# Altium project C-F-U-Bridge.PrjPcb
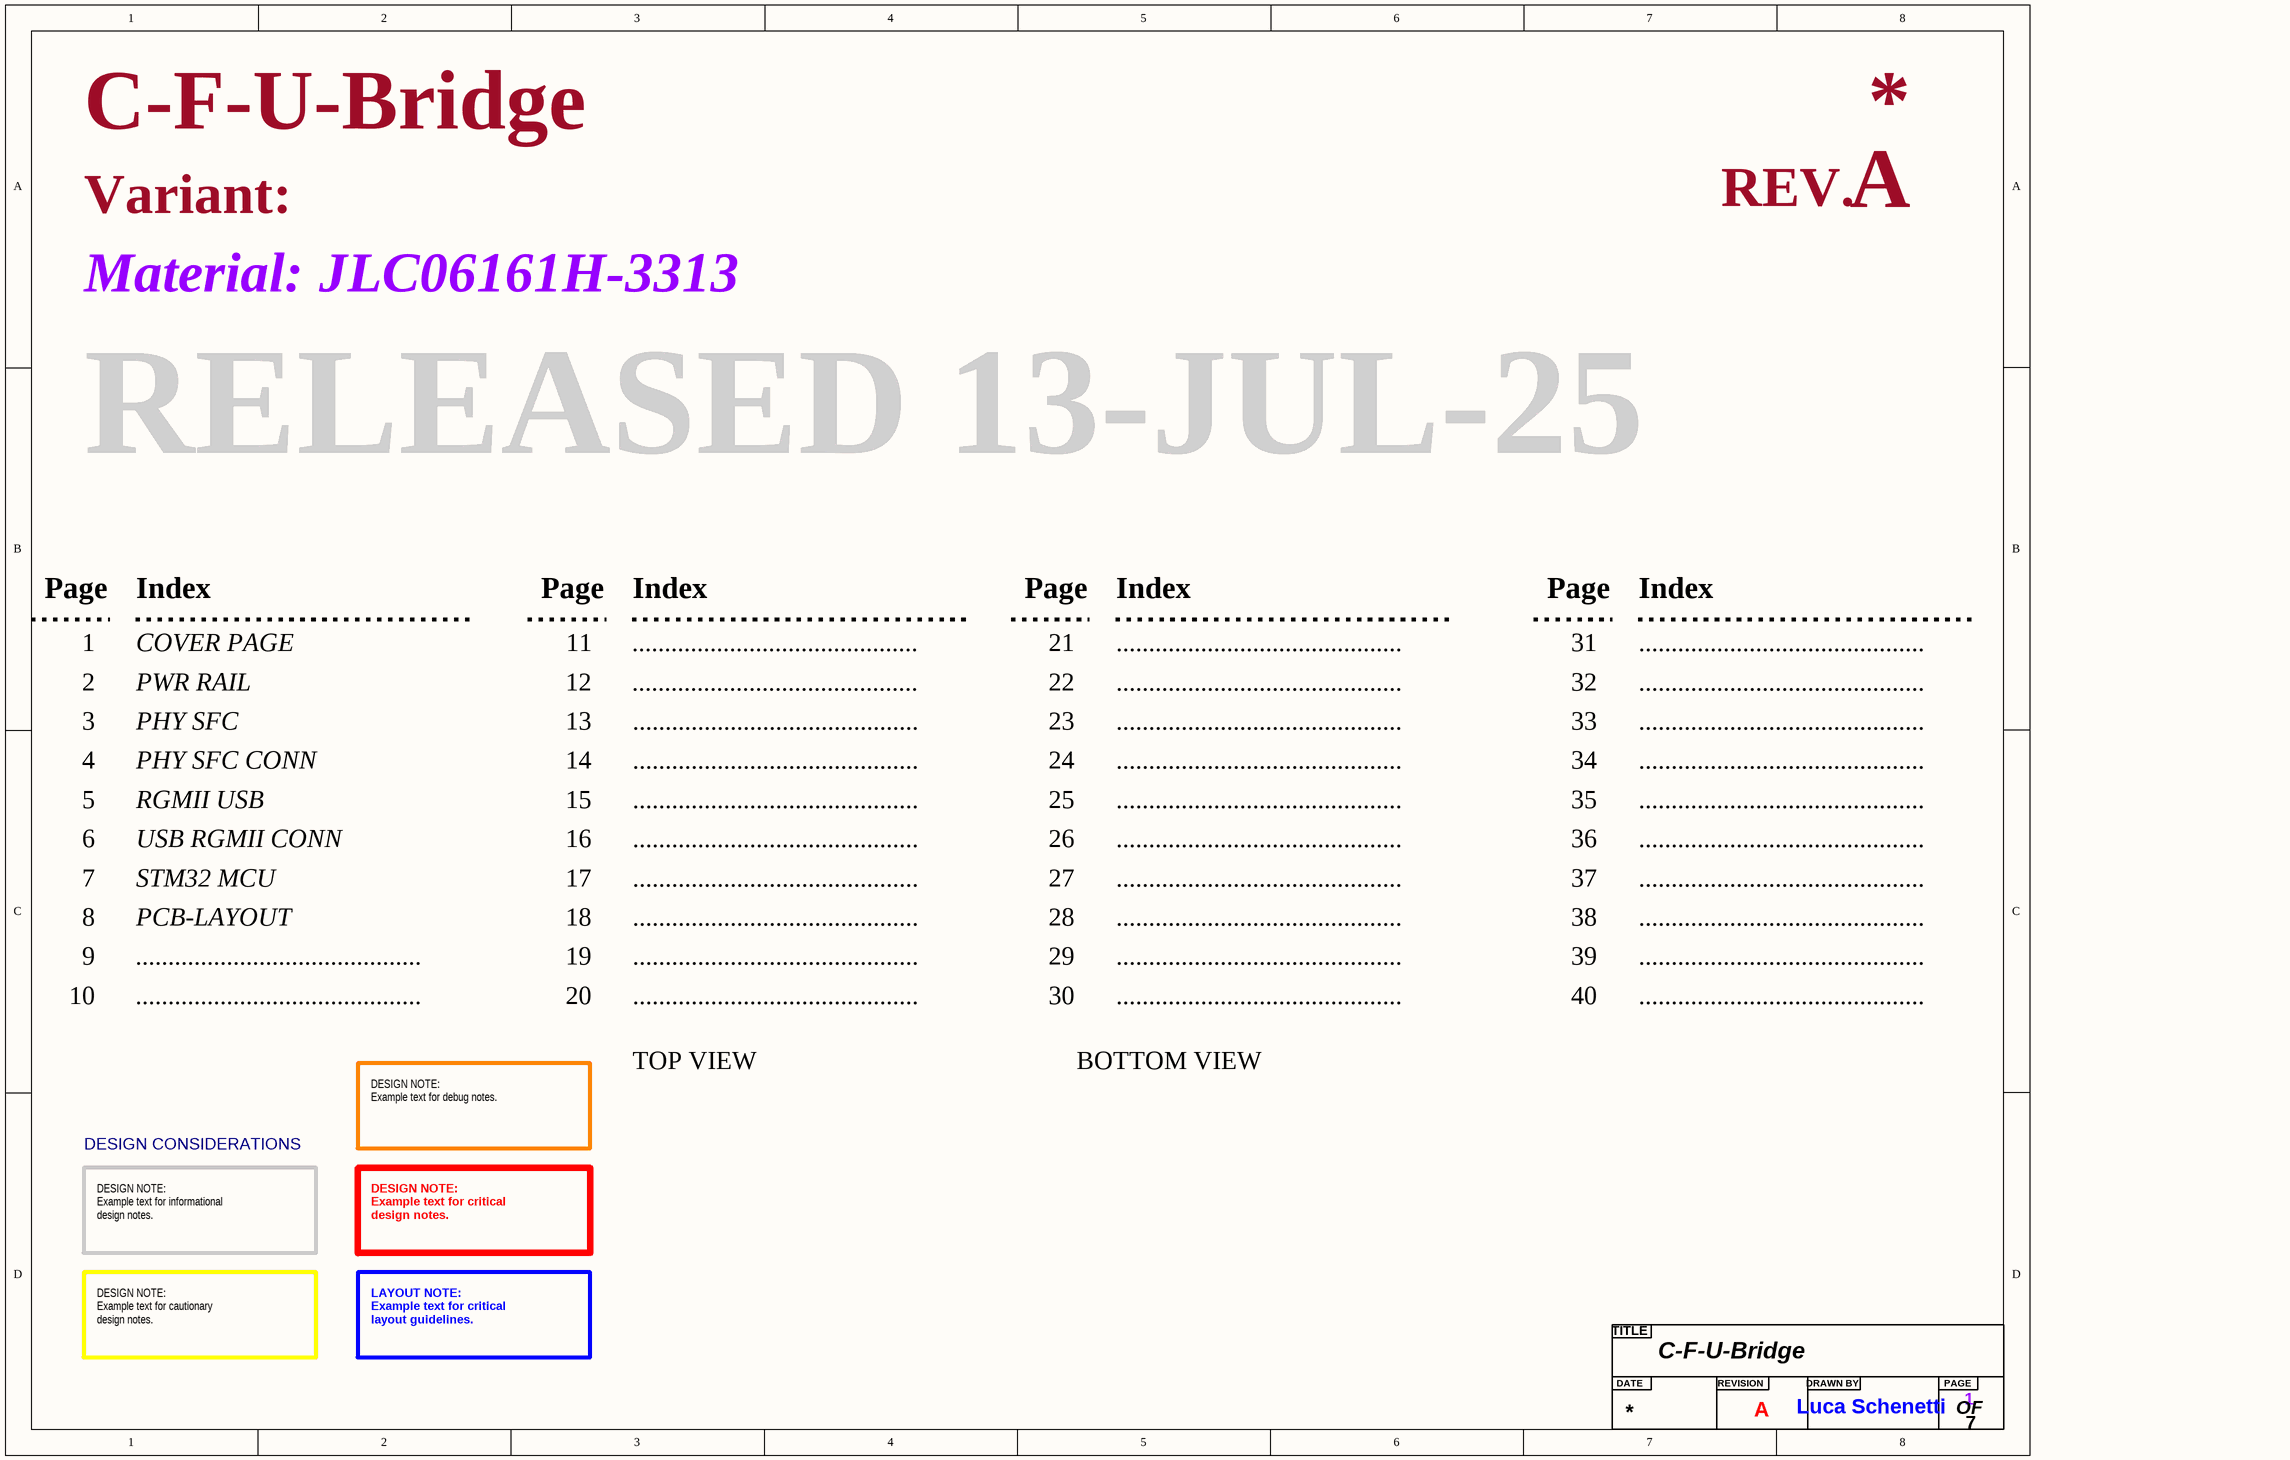
[diagram p0: COVER PAGE.SchDoc]
7 sheets, 212 parts. Net scope: flat (ports and power ports of the same name join across sheets).
Board file: PCB-LAYOUT.PcbDoc
Sheets:
  COVER PAGE.SchDoc
  PWR RAIL.SchDoc
  PHY SFC.SchDoc
  PHY SFC CONN.SchDoc
  RGMII USB.SchDoc
  USB RGMII CONN.SchDoc
  STM32 MCU.SchDoc

## Sheet COVER PAGE.SchDoc: C-F-U-Bridge
size A3; DrawnBy: Luca Schenetti; Engineer: Luca Schenetti; Revision: A; SheetNumber: 1; SheetTotal: 7; Material: JLC06161H-3313

### Parts
(Parts that share a designator on the sheet are numbered #1, #2 ... from top to bottom, then left to right.)
?#1  Title  (value not drawn)  (graphical)

### Notes on the sheet
- Variant:
- REV.
- Material:
- RELEASED 13-JUL-25
- Page
- Index
- 1
- 2
- COVER PAGE
- PWR RAIL
- 11
- 12
- ............................................
- 21
- 22
- 31
- 32
- 3
- PHY SFC
- 13
- 23
- 33
- 4
- 5
- PHY SFC CONN
- RGMII USB
- 14
- 15
- 24
- 25
- 34
- 35
- 6
- 7
- STM32 MCU
- USB RGMII CONN
- 16
- 17
- 26
- 27
- 36
- 37
- 8
- PCB-LAYOUT
- 18
- 28
- 38
- 9
- 10
- 19
- 20
- 29
- 30
- 39
- 40
- TOP VIEW
- BOTTOM VIEW
- DESIGN CONSIDERATIONS
- DESIGN NOTE:
  Example text for debug notes.
- DESIGN NOTE:
  Example text for informational
  design notes.
- DESIGN NOTE:
  Example text for critical
  design notes.
- DESIGN NOTE:
  Example text for cautionary
  design notes.
- LAYOUT NOTE:
  Example text for critical
  layout guidelines.
- (in symbol Title) TITLE; DATE; REVISION; DRAWN BY; PAGE; OF

## Sheet PWR RAIL.SchDoc: C-F-U-Bridge
size A3; ApprovedBy: Luca Schenetti; CheckedBy: Luca Schenetti; Author: Luca Schenetti; DrawnBy: Luca Schenetti; Engineer: Luca Schenetti; Revision: A; SheetNumber: 2; SheetTotal: 7
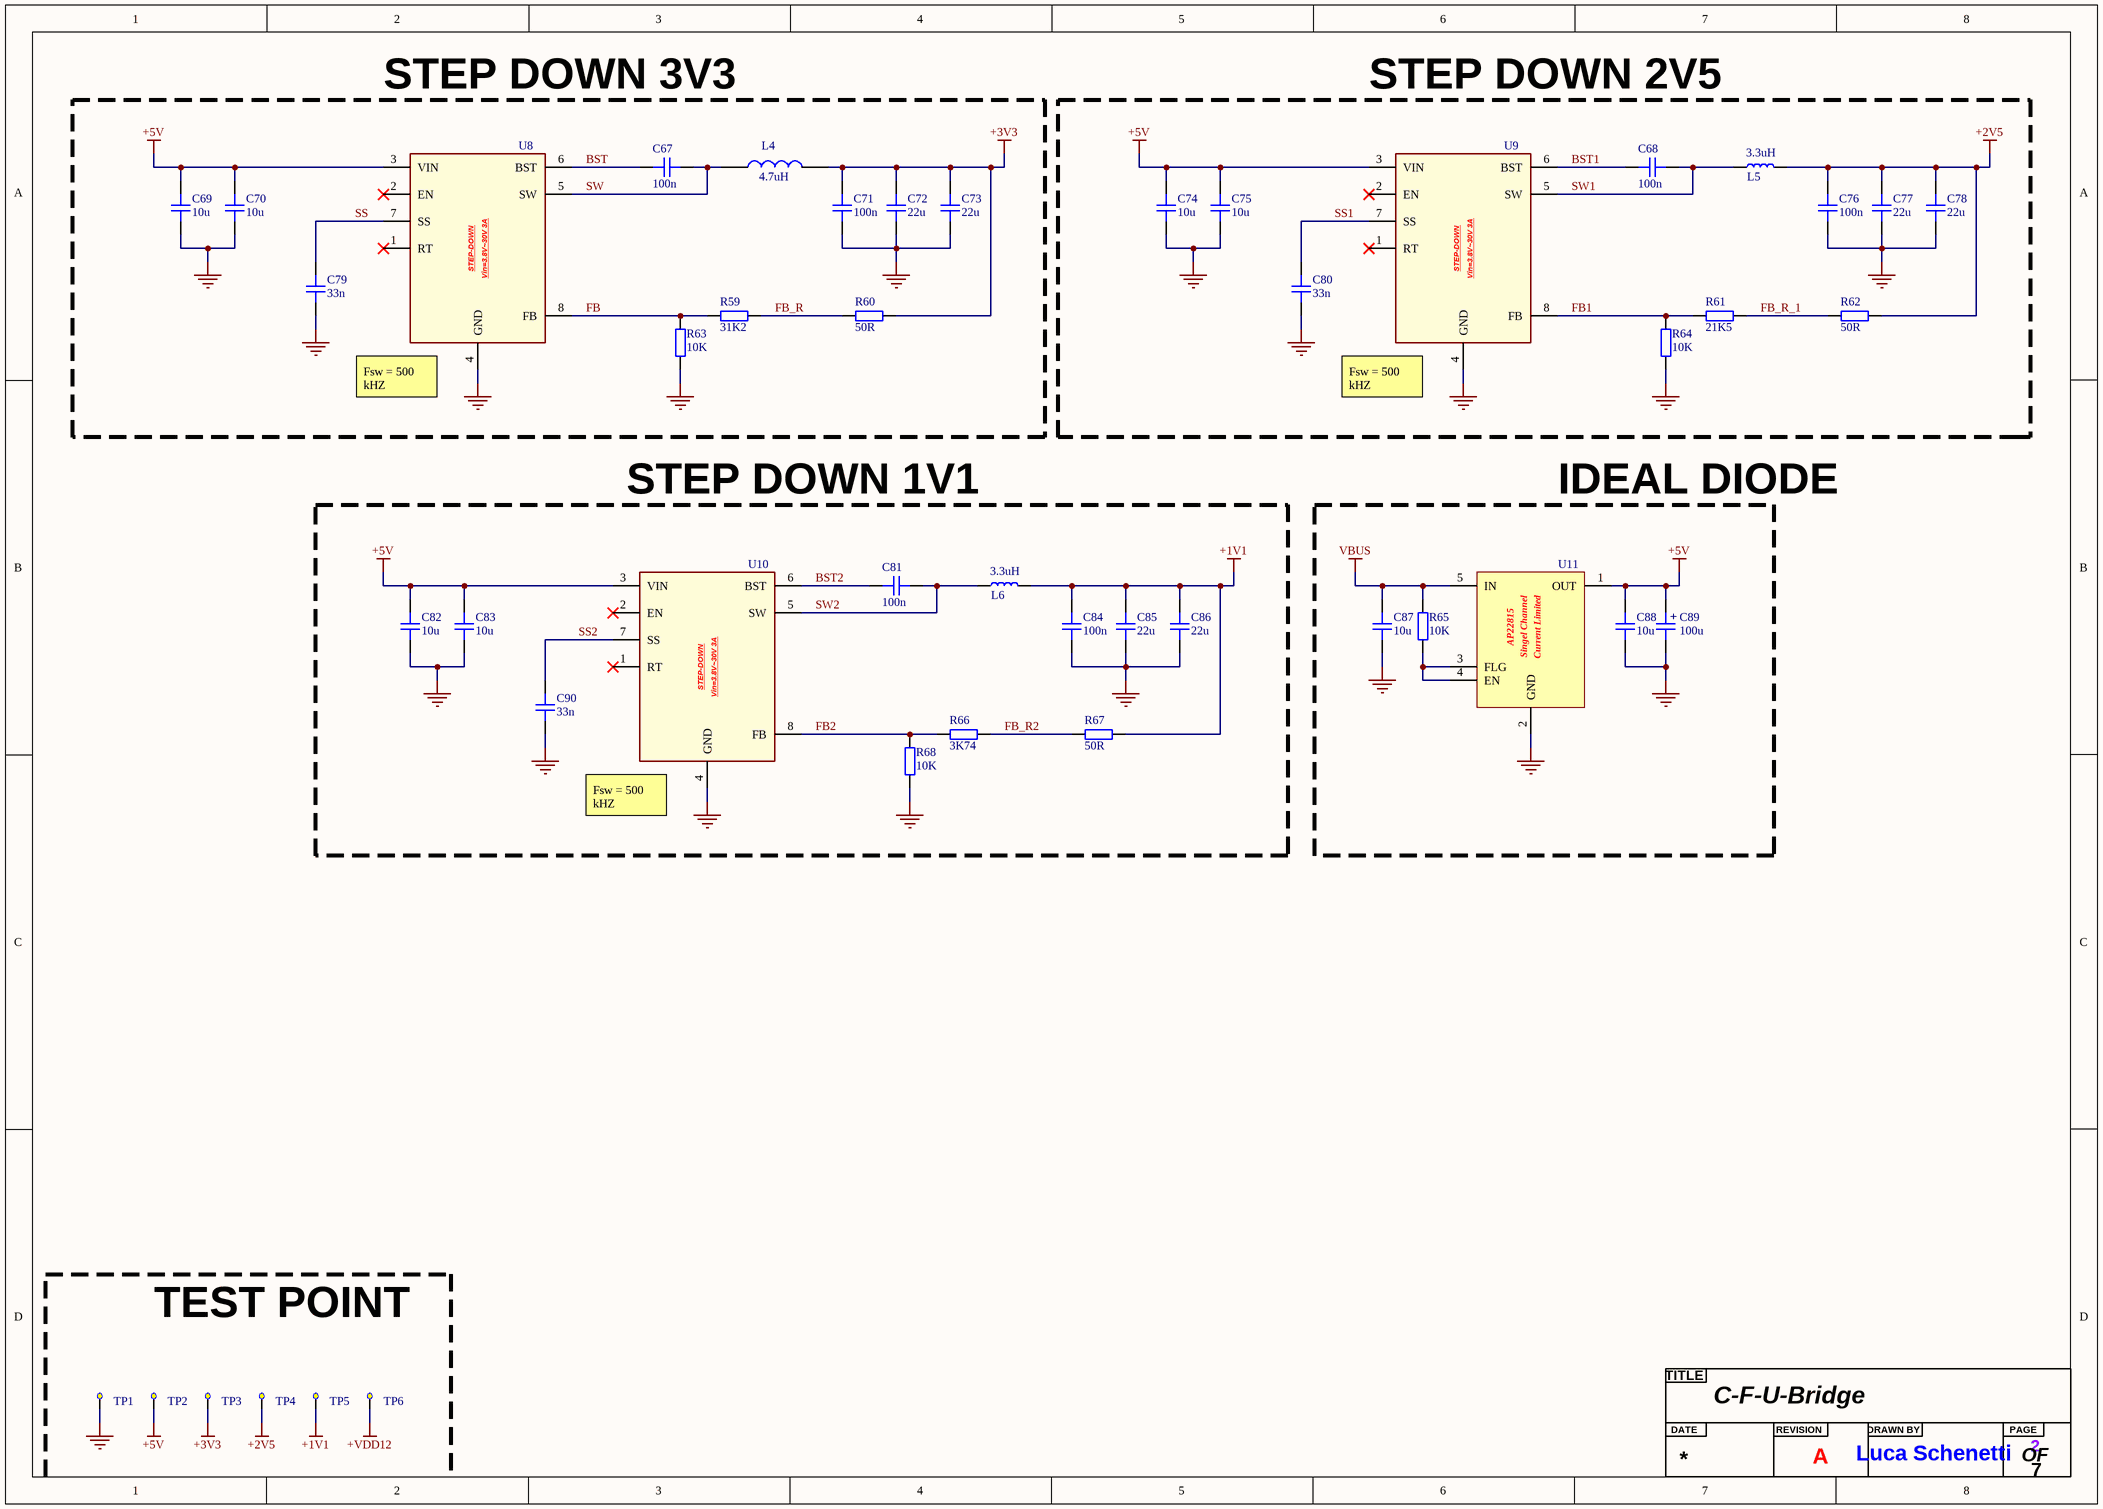
[diagram p1: PWR RAIL.SchDoc]

### Parts
(Parts that share a designator on the sheet are numbered #1, #2 ... from top to bottom, then left to right.)
?#2  Title  (value not drawn)  (graphical)
C67  100n  [CAP_0603]
C68  100n  [CAP_0603]
C69  10u  [CAP_0805]
C70  10u  [CAP_0805]
C71  100n  [CAP_0603]
C72  22u  [CAP_0603]
C73  22u  [CAP_0603]
C74  10u  [CAP_0805]
C75  10u  [CAP_0805]
C76  100n  [CAP_0603]
C77  22u  [CAP_0603]
C78  22u  [CAP_0603]
C79  33n  [CAP_0603]
C80  33n  [CAP_0603]
C81  100n  [CAP_0603]
C82  10u  [CAP_0805]
C83  10u  [CAP_0805]
C84  100n  [CAP_0603]
C85  22u  [CAP_0603]
C86  22u  [CAP_0603]
C87  10u  [CAP_0603]
C88  10u  [CAP_0603]
C89  100u  [CAP_AE_SMD_D6MM3_H5M55]
C90  33n  [CAP_0603]
L4  4.7uH  [FXL0530-4R7-M]
L5  3.3uH  [FXL0420-3R3-M]
L6  3.3uH  [FXL0420-3R3-M]
R59  31K2  [RES_0603]
R60  50R  [RES_0603]
R61  21K5  [RES_0603]
R62  50R  [RES_0603]
R63  10K  [RES_0603]
R64  10K  [RES_0603]
R65  10K  [RES_0603]
R66  3K74  [RES_0603]
R67  50R  [RES_0603]
R68  10K  [RES_0603]
TP1  Test Point  [Test Point]  (value not drawn)  (no BOM)
TP2  Test Point  [Test Point]  (value not drawn)  (no BOM)
TP3  Test Point  [Test Point]  (value not drawn)  (no BOM)
TP4  Test Point  [Test Point]  (value not drawn)  (no BOM)
TP5  Test Point  [Test Point]  (value not drawn)  (no BOM)
TP6  Test Point  [Test Point]  (value not drawn)  (no BOM)
U8  Step Down Converter 3A 3.8V~30V  [TPS62933DRLR]  (value not drawn)
U9  Step Down Converter 3A 3.8V~30V  [TPS62933DRLR]  (value not drawn)
U10  Step Down Converter 3A 3.8V~30V  [TPS62933DRLR]  (value not drawn)
U11  Single-Channel, Current-Limited  [AP22815]  (value not drawn)

### Blocks framed on the sheet
STEP DOWN 3V3: C67 C69-C73 C79 L4 R59 R60 R63 U8
STEP DOWN 2V5: C68 C74-C78 C80 L5 R61 R62 R64 U9
IDEAL DIODE: C87-C89 R65 U11

### Nets
+1V1: C84.1 C85.2 C86.2 L6.2 R67.1 TP5.1(Test_Point)
+2V5: C76.1 C77.2 C78.2 L5.2 R62.1 TP4.1(Test_Point)
+3V3: C71.1 C72.2 C73.2 L4.2 R60.1 TP3.1(Test_Point)
+5V: C69.2 C70.2 C74.2 C75.2 C82.2 C83.2 C88.2 C89.1 TP2.1(Test_Point) U8.3(VIN) U9.3(VIN) U10.3(VIN) U11.1(OUT)
+VDD12: TP6.1(Test_Point)
GND: C69.1 C70.1 C71.2 C72.1 C73.1 C74.1 C75.1 C76.2 C77.1 C78.1 C79.2 C80.2 C82.1 C83.1 C84.2 C85.1 C86.1 C87.1 C88.1 C89.2 C90.2 R63.1 R64.1 R68.1 TP1.1(Test_Point) U8.4(GND) U9.4(GND) U10.4(GND) U11.2(GND)
VBUS: C87.2 R65.2 U11.5(IN)
BST: C67.2 U8.6(BST)
BST1: C68.2 U9.6(BST)
BST2: C81.2 U10.6(BST)
FB: R59.2 R63.2 U8.8(FB)
FB1: R61.2 R64.2 U9.8(FB)
FB2: R66.2 R68.2 U10.8(FB)
FB_R: R59.1 R60.2
FB_R2: R66.1 R67.2
FB_R_1: R61.1 R62.2
SS: C79.1 U8.7(SS)
SS1: C80.1 U9.7(SS)
SS2: C90.1 U10.7(SS)
SW: C67.1 L4.1 U8.5(SW)
SW1: C68.1 L5.1 U9.5(SW)
SW2: C81.1 L6.1 U10.5(SW)
NetR65_1: R65.1 U11.3(FLG) U11.4(EN)

Not connected (* = marked no-connect by the designer): U8 1(RT)* 2(EN)*; U9 1(RT)* 2(EN)*; U10 1(RT)* 2(EN)*

### Notes on the sheet
- (near U8) Fsw = 500 kHZ
- (near U9) Fsw = 500 kHZ
- STEP DOWN 1V1
- (near U10) Fsw = 500 kHZ
- TEST POINT
- (in symbol AP22815AWT-7) AP22815; Singel Channel; Current Limited
- (in symbol CAP_ALEL_6.3x5.5) +
- (in symbol Title) TITLE; DATE; REVISION; DRAWN BY; PAGE; OF
- (in symbol TPS62933DRLR) STEP-DOWN; Vin=3.8V~30V 3A

### Library data of the parts
C67 C68 C71 C76 C81 C84 = CAP_0603: Capacitor SMD 0603 [C14663]; Manufacturer: *; Manufacturer Part Number: *; Distributor Link: *; LCSC: *; Rating: *; Dielectric: *
C69 C70 C74 C75 C82 C83 = CAP_0805: Capacitor SMD 0805[C440198]; Manufacturer: *; Manufacturer Part Number: *; Distributor Link: *; LCSC: *; Rating: *; Dielectric: *
C72 C73 C77 C78 C85 C86 = CAP_0603: Capacitor SMD 0603 [C59461]; Manufacturer: *; Manufacturer Part Number: *; Distributor Link: *; LCSC: *; Rating: *; Dielectric: *
C79 C80 C90 = CAP_0603: [C21117]; Manufacturer: *; Manufacturer Part Number: *; Distributor Link: *; LCSC: *; Rating: *; Dielectric: *
C87 C88 = CAP_0603: [C96446]; Manufacturer: *; Manufacturer Part Number: *; Distributor Link: *; LCSC: *; Rating: *; Dielectric: *
C89 = CAP_ALEL_6.3x5.5: [C59936]; Manufacturer: *; Manufacturer Part Number: *; Distributor Link: *; LCSC: *
L4 = FXL0530-4R7-M: [C177246]
L5 L6 = FXL0420-3R3-M: [C167207]
R59 = RES_0603: [C863036]; Manufacturer: *; Manufacturer Part Number: *; Distributor Link: *; LCSC: *
R60 R62 R67 = RES_0603: [C849792]; Manufacturer: *; Manufacturer Part Number: *; Distributor Link: *; LCSC: *
R61 = RES_0603: [C22911]; Manufacturer: *; Manufacturer Part Number: *; Distributor Link: *; LCSC: *
R63-R65 R68 = RES_0603: [C25804]; Manufacturer: *; Manufacturer Part Number: *; Distributor Link: *; LCSC: *
R66 = RES_0603: [C23016]; Manufacturer: *; Manufacturer Part Number: *; Distributor Link: *; LCSC: *
U8-U10 = TPS62933DRLR: [C3200405]
U11 = AP22815AWT-7: [C2150007]
TP1-TP6 = Test Point: Value: Test Point

## Sheet PHY SFC.SchDoc: C-F-U-Bridge
size A3; ApprovedBy: Luca Schenetti; CheckedBy: Luca Schenetti; Author: Luca Schenetti; Engineer: Luca Schenetti; Revision: A; SheetNumber: 3; SheetTotal: 7
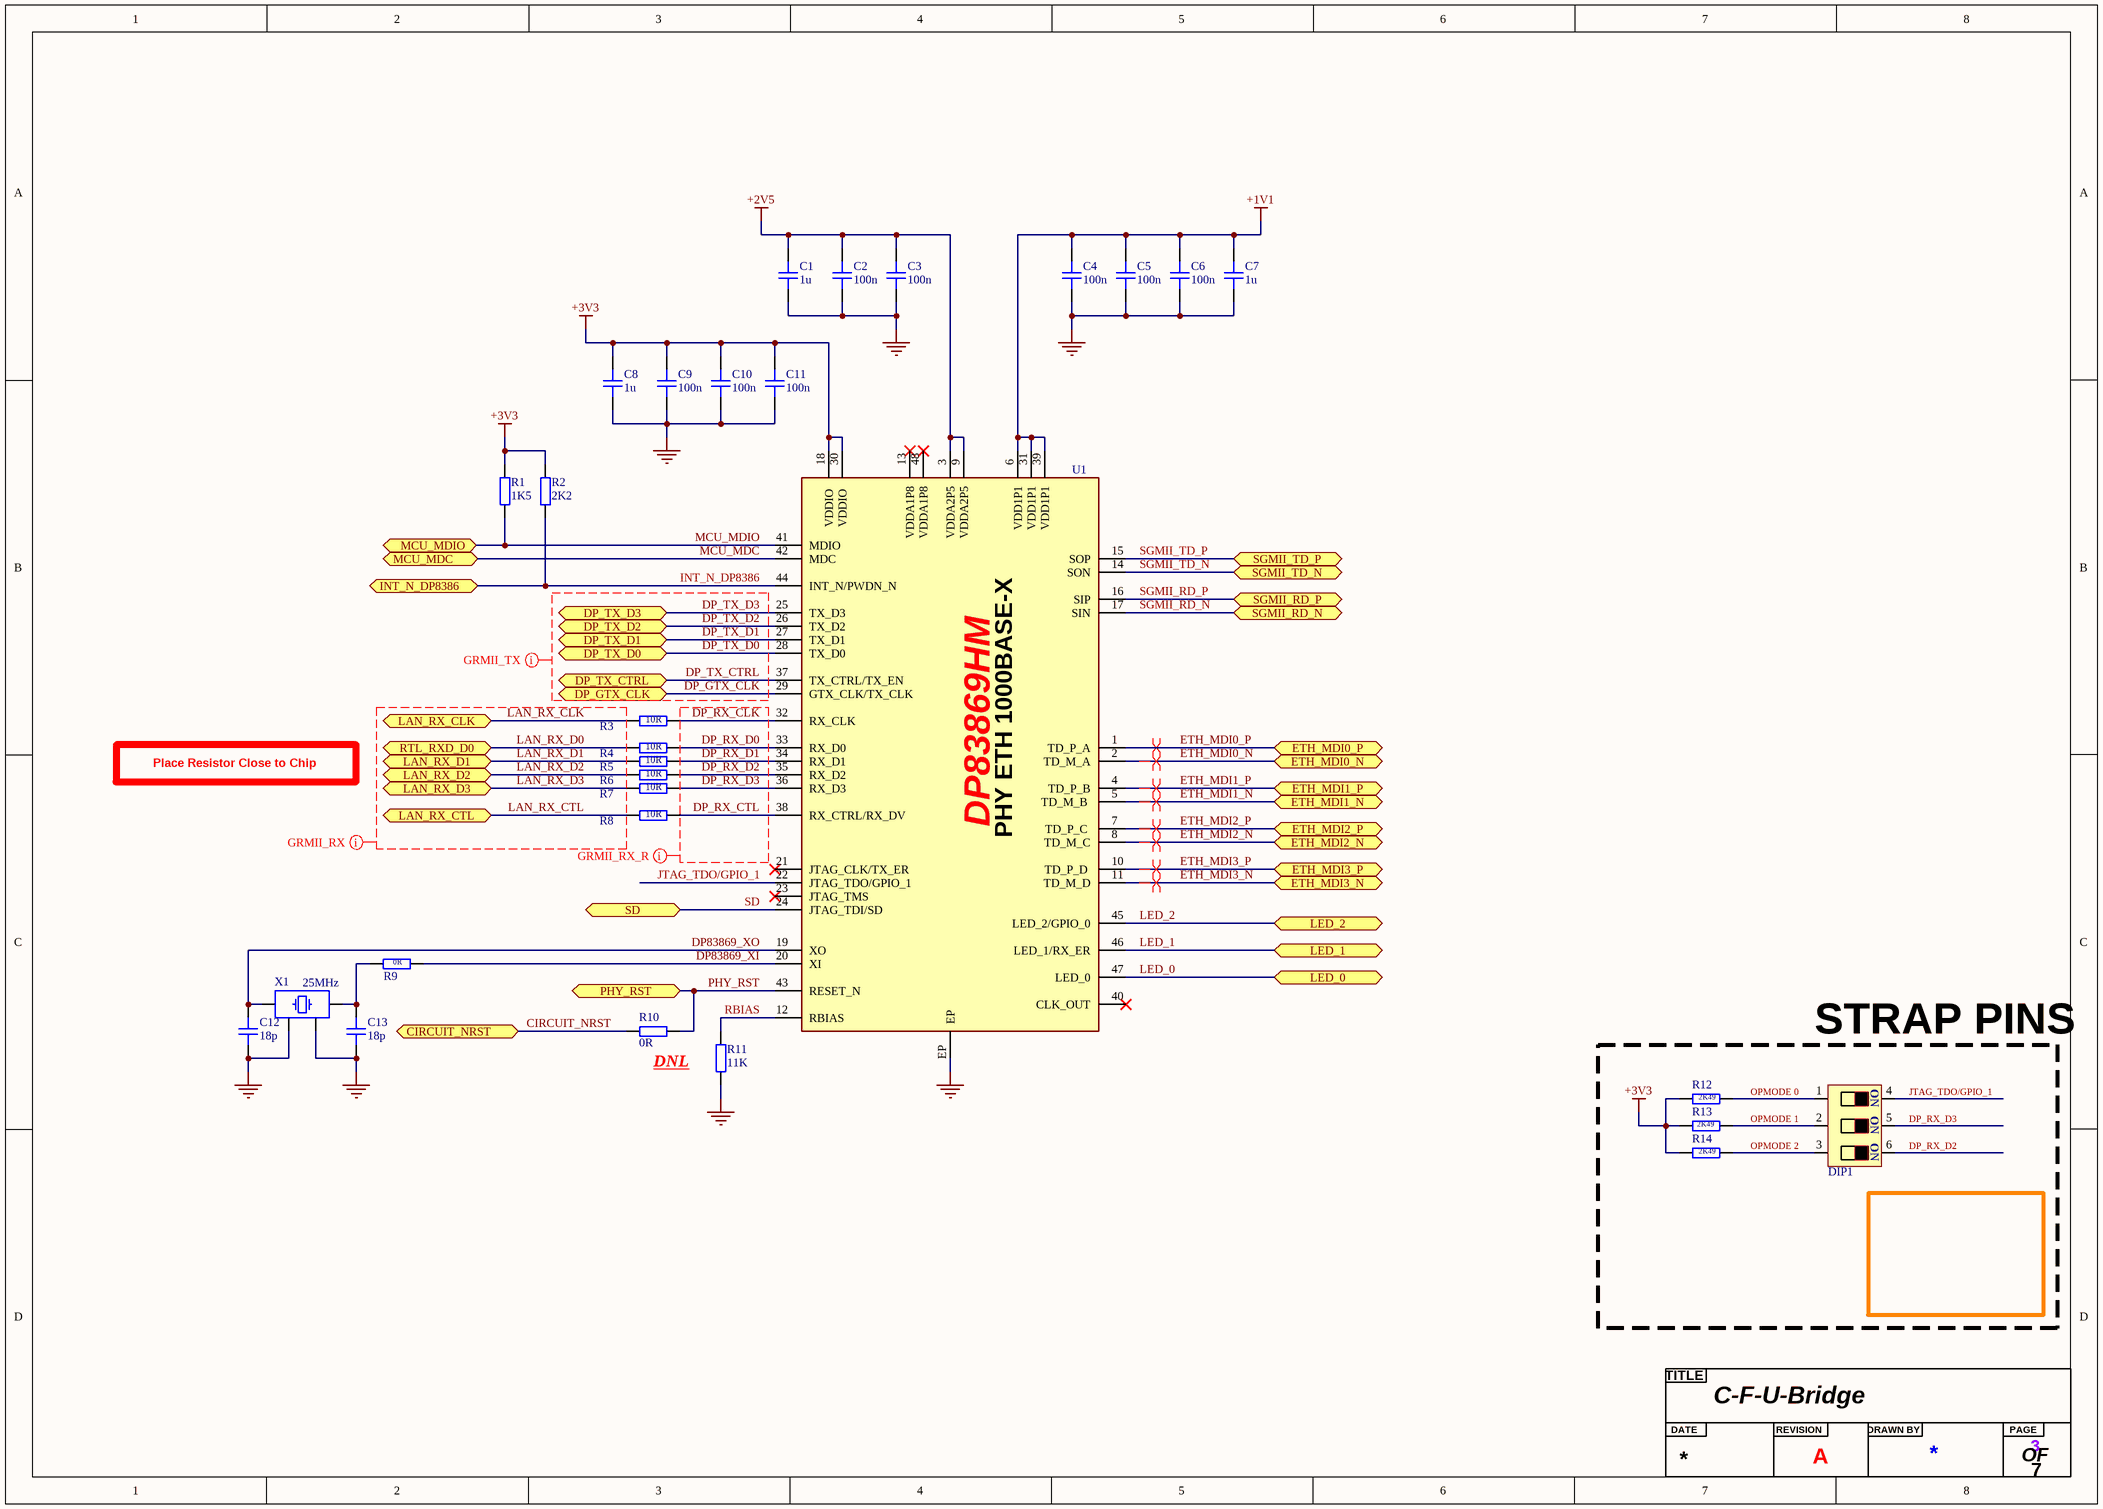
[diagram p2: PHY SFC.SchDoc]

### Parts
(Parts that share a designator on the sheet are numbered #1, #2 ... from top to bottom, then left to right.)
?#3  Title  (value not drawn)  (graphical)
C1  1u  [CAP_0603]
C2  100n  [CAP_0603]
C3  100n  [CAP_0603]
C4  100n  [CAP_0603]
C5  100n  [CAP_0603]
C6  100n  [CAP_0603]
C7  1u  [CAP_0603]
C8  1u  [CAP_0603]
C9  100n  [CAP_0603]
C10  100n  [CAP_0603]
C11  100n  [CAP_0603]
C12  18p  [CAP_0402]
C13  18p  [CAP_0402]
DIP1  3 POS DIP SWITCH  [DSWB03LHGET]  (value not drawn)
R1  1K5  [RES_0603]
R2  2K2  [RES_0603]
R3  10R  [RES_0402]
R4  10R  [RES_0402]
R5  10R  [RES_0402]
R6  10R  [RES_0402]
R7  10R  [RES_0402]
R8  10R  [RES_0402]
R9  0R  [RES_0402]
R10  0R  [RES_0603]  (no BOM)
R11  11K  [RES_0603]
R12  2K49  [RES_0603]
R13  2K49  [RES_0603]
R14  2K49  [RES_0603]
U1  PHY ETH 1000BASE-X/1000BASE-T  [DP83869HMRGZT]  (value not drawn)
X1  25MHz  [XTAL_3225]

### Blocks framed on the sheet
STRAP PINS: DIP1 R12-R14

### Ports
CIRCUIT_NRST (bidir, see RGMII USB[3D], STM32 MCU[7A]), DP_GTX_CLK (bidir, see RGMII USB[2C]), DP_TX_CTRL (bidir, see RGMII USB[2C]), DP_TX_D0 (bidir, see RGMII USB[2C]), DP_TX_D1 (bidir, see RGMII USB[2C]), DP_TX_D2 (bidir, see RGMII USB[2C]), DP_TX_D3 (bidir, see RGMII USB[2C]), ETH_MDI0_N (bidir, see PHY SFC CONN[1C]), ETH_MDI0_P (bidir, see PHY SFC CONN[1C]), ETH_MDI1_N (bidir, see PHY SFC CONN[1C]), ETH_MDI1_P (bidir, see PHY SFC CONN[1C]), ETH_MDI2_N (bidir, see PHY SFC CONN[1C]), ETH_MDI2_P (bidir, see PHY SFC CONN[1C]), ETH_MDI3_N (bidir, see PHY SFC CONN[1C]), ETH_MDI3_P (bidir, see PHY SFC CONN[1C]), INT_N_DP8386 (bidir, see STM32 MCU[2C]), LAN_RX_CLK (bidir, see RGMII USB[3C]), LAN_RX_CTL (bidir, see RGMII USB[3C]), LAN_RX_D1 (bidir, see RGMII USB[3C]), LAN_RX_D2 (bidir, see RGMII USB[3C]), LAN_RX_D3 (bidir, see RGMII USB[3C]), LED_0 (bidir, see PHY SFC CONN[5A]), LED_1 (bidir, see PHY SFC CONN[6B]), LED_2 (bidir, see PHY SFC CONN[5A]), MCU_MDC (bidir, see STM32 MCU[4C]), MCU_MDIO (bidir, see STM32 MCU[4C]), PHY_RST (bidir, see RGMII USB[3D]), RTL_RXD_D0 (bidir, see RGMII USB[3C]), SD (bidir, see PHY SFC CONN[4B]), SGMII_RD_N (bidir, see PHY SFC CONN[1B]), SGMII_RD_P (bidir, see PHY SFC CONN[1B]), SGMII_TD_N (bidir, see PHY SFC CONN[1B]), SGMII_TD_P (bidir, see PHY SFC CONN[1B])

### Nets
+1V1: C4.2 C5.2 C6.2 C7.2 U1.6(VDD1P1) U1.31(VDD1P1) U1.39(VDD1P1)
+2V5: C1.2 C2.2 C3.2 U1.3(VDDA2P5) U1.9(VDDA2P5)
+3V3: C8.2 C9.2 C10.2 C11.2 R1.2 R2.2 R12.2 R13.2 R14.2 U1.18(VDDIO) U1.30(VDDIO)
GND: C1.1 C2.1 C3.1 C4.1 C5.1 C6.1 C7.1 C8.1 C9.1 C10.1 C11.1 C12.1 C13.1 R11.1 U1.EP X1.2 X1.4
CIRCUIT_NRST: R10.1 ; port CIRCUIT_NRST
DP83869_XI: R9.2 U1.20(XI)
DP83869_XO: C12.2 U1.19(XO) X1.3
DP_GTX_CLK: U1.29(GTX_CLK/TX_CLK) ; port DP_GTX_CLK
DP_RX_CLK: R3.2 U1.32(RX_CLK)
DP_RX_CTL: R8.2 U1.38(RX_CTRL/RX_DV)
DP_RX_D0: R4.2 U1.33(RX_D0)
DP_RX_D1: R5.2 U1.34(RX_D1)
DP_RX_D2: DIP1.6 R6.2 U1.35(RX_D2)
DP_RX_D3: DIP1.5 R7.2 U1.36(RX_D3)
DP_TX_CTRL: U1.37(TX_CTRL/TX_EN) ; port DP_TX_CTRL
DP_TX_D0: U1.28(TX_D0) ; port DP_TX_D0
DP_TX_D1: U1.27(TX_D1) ; port DP_TX_D1
DP_TX_D2: U1.26(TX_D2) ; port DP_TX_D2
DP_TX_D3: U1.25(TX_D3) ; port DP_TX_D3
ETH_MDI0_N: U1.2(TD_M_A) ; port ETH_MDI0_N
ETH_MDI0_P: U1.1(TD_P_A) ; port ETH_MDI0_P
ETH_MDI1_N: U1.5(TD_M_B) ; port ETH_MDI1_N
ETH_MDI1_P: U1.4(TD_P_B) ; port ETH_MDI1_P
ETH_MDI2_N: U1.8(TD_M_C) ; port ETH_MDI2_N
ETH_MDI2_P: U1.7(TD_P_C) ; port ETH_MDI2_P
ETH_MDI3_N: U1.11(TD_M_D) ; port ETH_MDI3_N
ETH_MDI3_P: U1.10(TD_P_D) ; port ETH_MDI3_P
INT_N_DP8386: R2.1 U1.44(INT_N/PWDN_N) ; port INT_N_DP8386
JTAG_TDO/GPIO_1: DIP1.4 U1.22(JTAG_TDO/GPIO_1)
LAN_RX_CLK: R3.1 ; port LAN_RX_CLK
LAN_RX_CTL: R8.1 ; port LAN_RX_CTL
LAN_RX_D0: R4.1 ; port RTL_RXD_D0
LAN_RX_D1: R5.1 ; port LAN_RX_D1
LAN_RX_D2: R6.1 ; port LAN_RX_D2
LAN_RX_D3: R7.1 ; port LAN_RX_D3
LED_0: U1.47(LED_0) ; port LED_0
LED_1: U1.46(LED_1/RX_ER) ; port LED_1
LED_2: U1.45(LED_2/GPIO_0) ; port LED_2
MCU_MDC: U1.42(MDC) ; port MCU_MDC
MCU_MDIO: R1.1 U1.41(MDIO) ; port MCU_MDIO
OPMODE 0: DIP1.1 R12.1
OPMODE 1: DIP1.2 R13.1
OPMODE 2: DIP1.3 R14.1
PHY_RST: R10.2 U1.43(RESET_N) ; port PHY_RST
RBIAS: R11.2 U1.12(RBIAS)
SD: U1.24(JTAG_TDI/SD) ; port SD
SGMII_RD_N: U1.17(SIN) ; port SGMII_RD_N
SGMII_RD_P: U1.16(SIP) ; port SGMII_RD_P
SGMII_TD_N: U1.14(SON) ; port SGMII_TD_N
SGMII_TD_P: U1.15(SOP) ; port SGMII_TD_P
NetC13_2: C13.2 R9.1 X1.1

Not connected (* = marked no-connect by the designer): U1 13(VDDA1P8)* 21(JTAG_CLK/TX_ER)* 23(JTAG_TMS)* 40(CLK_OUT)* 48(VDDA1P8)*

### Layout directives
differential pair; differential pair class DIFF_MDI_100Ω; rule Matched Net Lengths [Delay Tolerance = 50ps]: ETH_MDI0_N, ETH_MDI0_P, ETH_MDI1_N, ETH_MDI1_P, ETH_MDI2_N, ETH_MDI2_P, ETH_MDI3_N, ETH_MDI3_P
net class GRMII_RX_R; rule Matched Net Lengths [Delay Tolerance = 20ps]: DP_RX_CLK, DP_RX_CTL, DP_RX_D0, DP_RX_D1, DP_RX_D2, DP_RX_D3
net class GRMII_TX; rule Matched Net Lengths [Delay Tolerance = 20ps]: DP_GTX_CLK, DP_TX_CTRL, DP_TX_D0, DP_TX_D1, DP_TX_D2, DP_TX_D3
net class GRMII_RX; rule Matched Net Lengths [Delay Tolerance = 20ps]: LAN_RX_CLK, LAN_RX_CTL, LAN_RX_D0, LAN_RX_D1, LAN_RX_D2, LAN_RX_D3

### Notes on the sheet
- Place Resistor Close to Chip
- (near R10) DNL
- (in symbol DP83869HMRGZT) PHY ETH 1000BASE-X; DP83869HM
- (in symbol DSWB03LHGET) ON
- (in symbol Title) TITLE; DATE; REVISION; DRAWN BY; PAGE; OF

### Library data of the parts
C1 C7 C8 = CAP_0603: [C15849]; Manufacturer: *; Manufacturer Part Number: *; Distributor Link: *; LCSC: *; Rating: *; Dielectric: *
C2-C6 C9-C11 = CAP_0603: [C14663]; Manufacturer: *; Manufacturer Part Number: *; Distributor Link: *; LCSC: *; Rating: *; Dielectric: *
C12 C13 = CAP_0402: Capacitor SMD 0402 [C1549]; Manufacturer: *; Manufacturer Part Number: *; Distributor Link: *; LCSC: *; Rating: *; Dielectric: *
DIP1 = DSWB03LHGET: [C99420]
R1 = RES_0603: [C22843]; Manufacturer: *; Manufacturer Part Number: *; Distributor Link: *; LCSC: *
R2 = RES_0603: [C4190]; Manufacturer: *; Manufacturer Part Number: *; Distributor Link: *; LCSC: *
R3-R8 = RES_0402: [C25077]; Manufacturer: *; Manufacturer Part Number: *; Distributor Link: *; LCSC: *
R9 = RES_0402: Resistor SMD 0402 [C17168]; Manufacturer: *; Manufacturer Part Number: *; Distributor Link: *; LCSC: *
R10 = RES_0603: Manufacturer: *; Manufacturer Part Number: *; Distributor Link: *; LCSC: *
R11 = RES_0603: [C25950]; Manufacturer: *; Manufacturer Part Number: *; Distributor Link: *; LCSC: *
R12-R14 = RES_0603: [C22908]; Manufacturer: *; Manufacturer Part Number: *; Distributor Link: *; LCSC: *
U1 = DP83869HMRGZT: [C2671580]
X1 = TSX-3225_24.0000MF15X-AC: Crystal SMD 24MHz 10PPM 7pF 3225 [C9006]; Manufacturer: Epson; Manufacturer Part Number: TSX-3225 24.0000MF15X-AC

## Sheet PHY SFC CONN.SchDoc: C-F-U-Bridge
size A3; ApprovedBy: Luca Schenetti; CheckedBy: Luca Schenetti; Author: Luca Schenetti; DrawnBy: Luca Schenetti; Revision: A; SheetNumber: 4; SheetTotal: 7
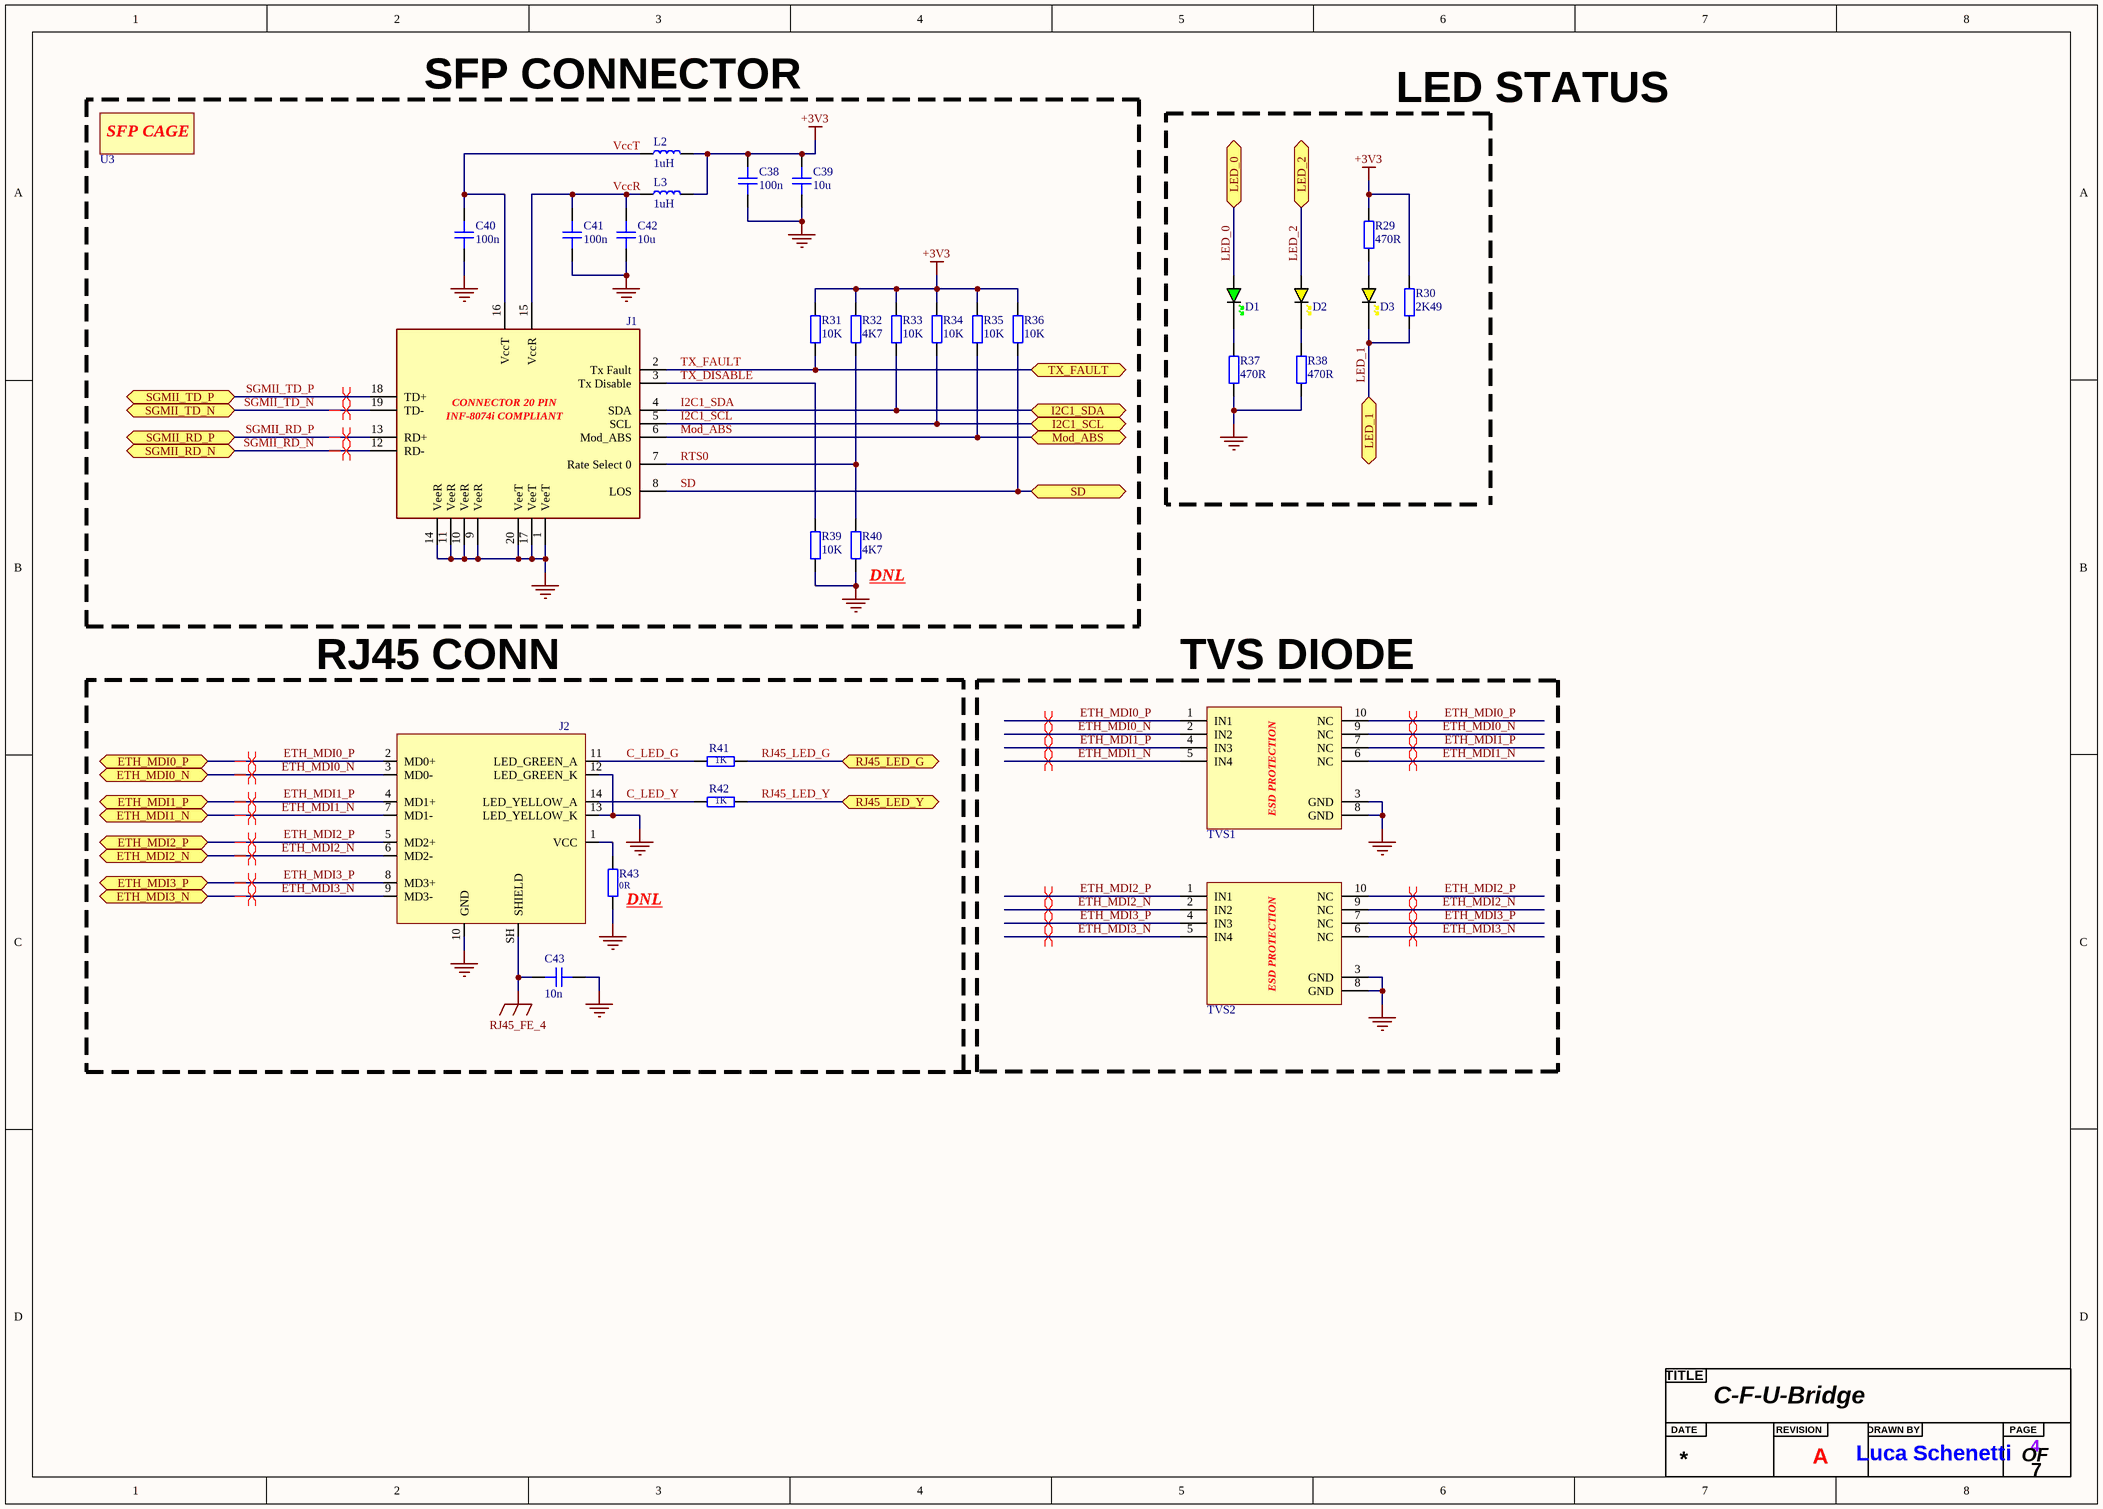
[diagram p3: PHY SFC CONN.SchDoc]

### Parts
(Parts that share a designator on the sheet are numbered #1, #2 ... from top to bottom, then left to right.)
?#4  Title  (value not drawn)  (graphical)
C38  100n  [CAP_0603]
C39  10u  [CAP_0603]
C40  100n  [CAP_0603]
C41  100n  [CAP_0603]
C42  10u  [CAP_0603]
C43  10n  [CAP_1206]
D1  GREEN  [LED_0603_GREEN]  (value not drawn)
D2  YELLOW  [LED_0603_YELLOW]  (value not drawn)
D3  YELLOW  [LED_0603_YELLOW]  (value not drawn)
J1  SHELL 20 PIN FOR SFP CAGE  [1367073-1]  (value not drawn)
J2  100/1000Base-T RJ45 MAGJACK  [HR911130A]  (value not drawn)
L2  1uH  [IND_0603]
L3  1uH  [IND_0603]
R29  470R  [RES_0603]
R30  2K49  [RES_0603]
R31  10K  [RES_0402]
R32  4K7  [RES_0402]
R33  10K  [RES_0402]
R34  10K  [RES_0402]
R35  10K  [RES_0402]
R36  10K  [RES_0402]
R37  470R  [RES_0603]
R38  470R  [RES_0603]
R39  10K  [RES_0402]
R40  4K7  [RES_0402]  (no BOM)
R41  1K  [RES_0603]
R42  1K  [RES_0603]
R43  0R  [RES_0402]  (no BOM)
TVS1  TVS ARRAY  [RClamp0524PATCT]  (value not drawn)
TVS2  TVS ARRAY  [RClamp0524PATCT]  (value not drawn)
U3  SFP-CAGE  [2227023-1]  (value not drawn)

### Blocks framed on the sheet
SFP CONNECTOR: C38-C42 J1 L2 L3 R31-R36 R39 R40 U3

### Ports
ETH_MDI0_N (bidir, see PHY SFC[5C]), ETH_MDI0_P (bidir, see PHY SFC[5B]), ETH_MDI1_N (bidir, see PHY SFC[5C]), ETH_MDI1_P (bidir, see PHY SFC[5C]), ETH_MDI2_N (bidir, see PHY SFC[5C]), ETH_MDI2_P (bidir, see PHY SFC[5C]), ETH_MDI3_N (bidir, see PHY SFC[5C]), ETH_MDI3_P (bidir, see PHY SFC[5C]), I2C1_SCL (bidir, see STM32 MCU[4C]), I2C1_SDA (bidir, see STM32 MCU[4C]), LED_0 (bidir, see PHY SFC[5C]), LED_1 (bidir, see PHY SFC[5C]), LED_2 (bidir, see PHY SFC[5C]), Mod_ABS (bidir, see STM32 MCU[2D]), RJ45_LED_G (bidir, see STM32 MCU[2C]), RJ45_LED_Y (bidir, see STM32 MCU[2C]), SD (bidir, see PHY SFC[3C]), SGMII_RD_N (bidir, see PHY SFC[5B]), SGMII_RD_P (bidir, see PHY SFC[5B]), SGMII_TD_N (bidir, see PHY SFC[5B]), SGMII_TD_P (bidir, see PHY SFC[5B]), TX_FAULT (bidir, see STM32 MCU[4C])

### Nets
+3V3: C38.2 C39.2 L2.1 L3.1 R29.2 R30.2 R31.2 R32.2 R33.2 R34.2 R35.2 R36.2
GND: C38.1 C39.1 C40.1 C41.1 C42.1 C43.2 J1.1(VeeT) J1.9(VeeR) J1.10(VeeR) J1.11(VeeR) J1.14(VeeR) J1.17(VeeT) J1.20(VeeT) J2.10(GND) J2.12(LED_GREEN_K) J2.13(LED_YELLOW_K) R37.1 R38.1 R39.1 R40.1 R43.1 TVS1.3(GND) TVS1.8(GND) TVS2.3(GND) TVS2.8(GND)
RJ45_FE_4: C43.1 J2.SH(SHIELD)
C_LED_G: J2.11(LED_GREEN_A) R41.2
C_LED_Y: J2.14(LED_YELLOW_A) R42.2
ETH_MDI0_N: J2.3(MD0-) TVS1.2(IN2) TVS1.9(NC) ; port ETH_MDI0_N
ETH_MDI0_P: J2.2(MD0+) TVS1.1(IN1) TVS1.10(NC) ; port ETH_MDI0_P
ETH_MDI1_N: J2.7(MD1-) TVS1.5(IN4) TVS1.6(NC) ; port ETH_MDI1_N
ETH_MDI1_P: J2.4(MD1+) TVS1.4(IN3) TVS1.7(NC) ; port ETH_MDI1_P
ETH_MDI2_N: J2.6(MD2-) TVS2.2(IN2) TVS2.9(NC) ; port ETH_MDI2_N
ETH_MDI2_P: J2.5(MD2+) TVS2.1(IN1) TVS2.10(NC) ; port ETH_MDI2_P
ETH_MDI3_N: J2.9(MD3-) TVS2.5(IN4) TVS2.6(NC) ; port ETH_MDI3_N
ETH_MDI3_P: J2.8(MD3+) TVS2.4(IN3) TVS2.7(NC) ; port ETH_MDI3_P
I2C1_SCL: J1.5(SCL) R34.1 ; port I2C1_SCL
I2C1_SDA: J1.4(SDA) R33.1 ; port I2C1_SDA
LED_0: D1.A ; port LED_0
LED_1: D3.K R30.1 ; port LED_1
LED_2: D2.A ; port LED_2
Mod_ABS: J1.6(Mod_ABS) R35.1 ; port Mod_ABS
RJ45_LED_G: R41.1 ; port RJ45_LED_G
RJ45_LED_Y: R42.1 ; port RJ45_LED_Y
RTS0: J1.7(Rate_Select_0) R32.1 R40.2
SD: J1.8(LOS) R36.1 ; port SD
SGMII_RD_N: J1.12(RD-) ; port SGMII_RD_N
SGMII_RD_P: J1.13(RD+) ; port SGMII_RD_P
SGMII_TD_N: J1.19(TD-) ; port SGMII_TD_N
SGMII_TD_P: J1.18(TD+) ; port SGMII_TD_P
TX_DISABLE: J1.3(Tx_Disable) R39.2
TX_FAULT: J1.2(Tx_Fault) R31.1 ; port TX_FAULT
VccR: C41.2 C42.2 J1.15(VccR) L3.2
VccT: C40.2 J1.16(VccT) L2.2
NetD1_K: D1.K R37.2
NetD2_K: D2.K R38.2
NetD3_A: D3.A R29.1
NetJ2_1: J2.1(VCC) R43.2

### Layout directives
differential pair; differential pair class DIFF_SGMII_100Ω; rule Matched Net Lengths [Delay Tolerance = 15ps]: SGMII_RD_N, SGMII_RD_P, SGMII_TD_N, SGMII_TD_P
differential pair; differential pair class DIFF_MDI_100Ω: ETH_MDI0_N, ETH_MDI0_P, ETH_MDI1_N, ETH_MDI1_P, ETH_MDI2_N, ETH_MDI2_P, ETH_MDI3_N, ETH_MDI3_P
differential pair; differential pair class DIFF_MDI_100Ω; rule Matched Net Lengths [Delay Tolerance = 50ps]: ETH_MDI0_N, ETH_MDI0_P, ETH_MDI1_N, ETH_MDI1_P, ETH_MDI2_N, ETH_MDI2_P, ETH_MDI3_N, ETH_MDI3_P

### Notes on the sheet
- LED STATUS
- (near R40) DNL
- RJ45 CONN
- (near TVS1) TVS DIODE
- (near R43) DNL
- (in symbol 1367073-1) CONNECTOR 20 PIN; INF‑8074i COMPLIANT
- (in symbol 2227023-1) SFP CAGE
- (in symbol RClamp0524PATCT) ESD PROTECTION
- (in symbol Title) TITLE; DATE; REVISION; DRAWN BY; PAGE; OF

### Library data of the parts
C38 C40 C41 = CAP_0603: [C14663]; Manufacturer: *; Manufacturer Part Number: *; Distributor Link: *; LCSC: *; Rating: *; Dielectric: *
C39 C42 = CAP_0603: [C19702]; Manufacturer: *; Manufacturer Part Number: *; Distributor Link: *; LCSC: *; Rating: *; Dielectric: *
C43 = CAP_1206: [C1846]; Manufacturer: *; Manufacturer Part Number: *; Distributor Link: *; LCSC: *; Rating: *; Dielectric: *
D1 = LED_0603_GREEN: [C2986059]
D2 D3 = LED_0603_YELLOW: [C84269]
J1 = 1367073-1: [C210158]
J2 = HR911130A: [C54408]; Manufacturer: Hanrun; Manufacturer Part Number: HR911130A
L2 L3 = IND_0603: [C383366]
R29 R37 R38 = RES_0603: [C23179]; Manufacturer: *; Manufacturer Part Number: *; Distributor Link: *; LCSC: *
R30 = RES_0603: [C22908]; Manufacturer: *; Manufacturer Part Number: *; Distributor Link: *; LCSC: *
R31 R33-R36 R39 = RES_0402: [C25744]; Manufacturer: *; Manufacturer Part Number: *; Distributor Link: *; LCSC: *
R32 = RES_0402: [C23162]; Manufacturer: *; Manufacturer Part Number: *; Distributor Link: *; LCSC: *
R40 = RES_0402: Manufacturer: *; Manufacturer Part Number: *; Distributor Link: *; LCSC: *
R41 R42 = RES_0603: [C21190]; Manufacturer: *; Manufacturer Part Number: *; Distributor Link: *; LCSC: *
R43 = RES_0402: Resistor SMD 0402; Manufacturer: *; Manufacturer Part Number: *; Distributor Link: *; LCSC: *
TVS1 TVS2 = RClamp0524PATCT: [C40960]
U3 = 2227023-1: [C589693]

## Sheet RGMII USB.SchDoc: C-F-U-Bridge
size A3; ApprovedBy: Luca Schenetti; CheckedBy: Luca Schenetti; Author: Luca Schenetti; CompanyName: Luca Schenetti; DrawnBy: Luca Schenetti; Engineer: Luca Schenetti; Revision: A; SheetNumber: 5; SheetTotal: 7
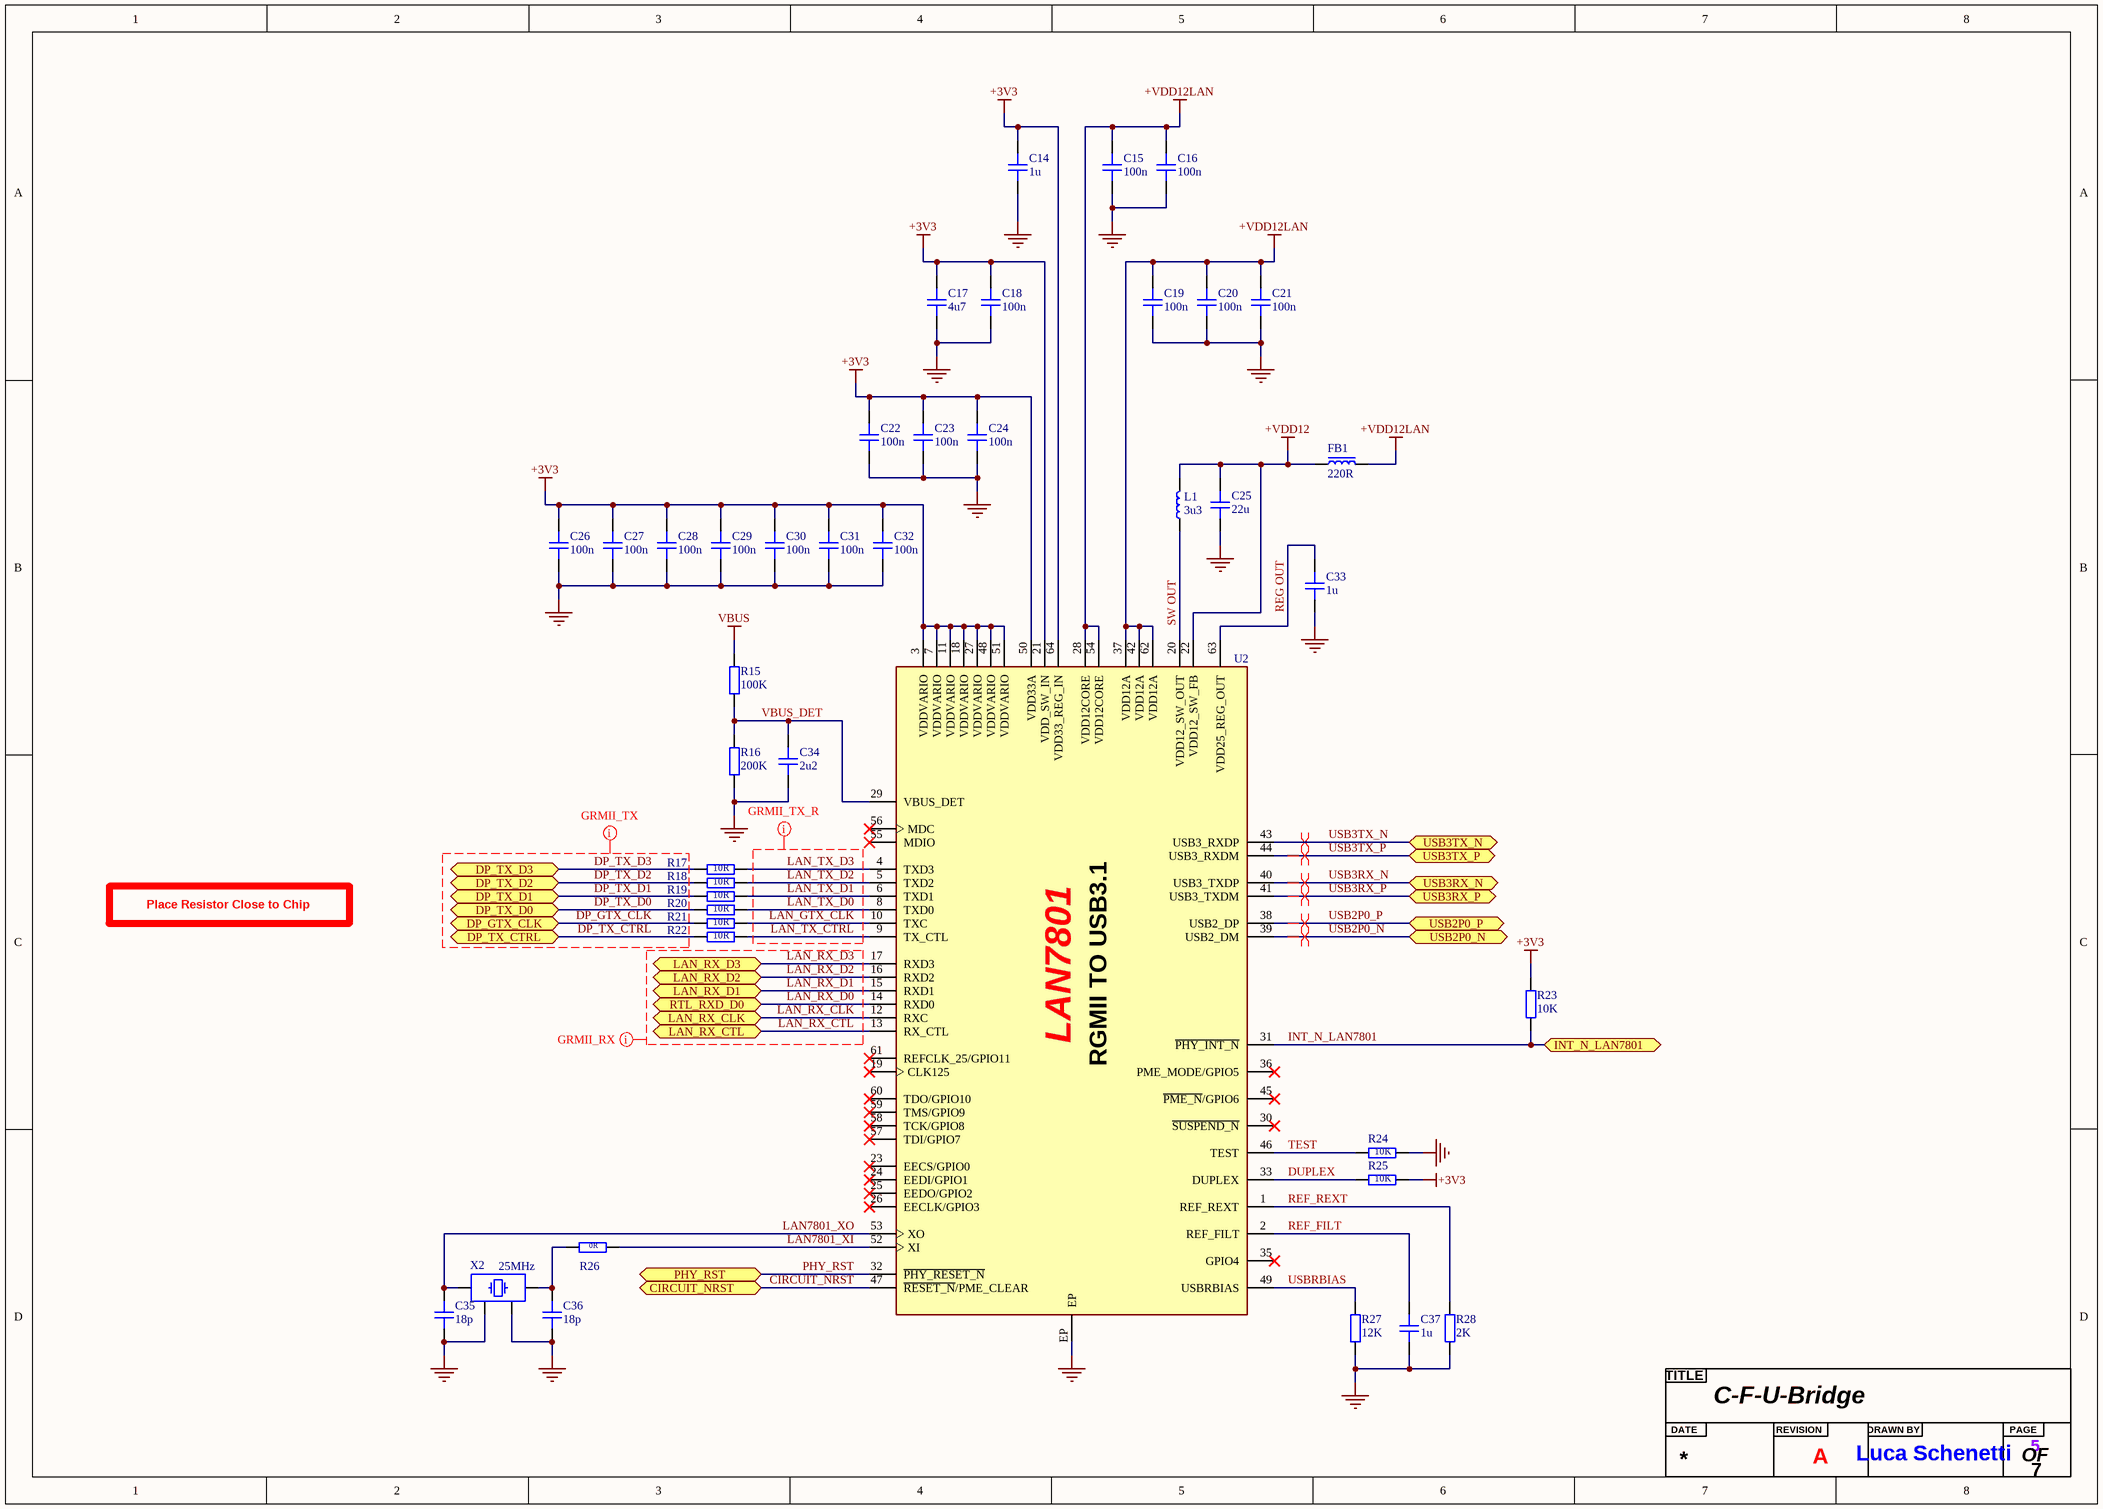
[diagram p4: RGMII USB.SchDoc]

### Parts
(Parts that share a designator on the sheet are numbered #1, #2 ... from top to bottom, then left to right.)
?#5  Title  (value not drawn)  (graphical)
C14  1u  [CAP_0603]
C15  100n  [CAP_0603]
C16  100n  [CAP_0603]
C17  4u7  [CAP_0603]
C18  100n  [CAP_0603]
C19  100n  [CAP_0603]
C20  100n  [CAP_0603]
C21  100n  [CAP_0603]
C22  100n  [CAP_0603]
C23  100n  [CAP_0603]
C24  100n  [CAP_0603]
C25  22u  [CAP_0603]
C26  100n  [CAP_0603]
C27  100n  [CAP_0603]
C28  100n  [CAP_0603]
C29  100n  [CAP_0603]
C30  100n  [CAP_0603]
C31  100n  [CAP_0603]
C32  100n  [CAP_0603]
C33  1u  [CAP_0603]
C34  2u2  [CAP_0603]
C35  18p  [CAP_0402]
C36  18p  [CAP_0402]
C37  1u  [CAP_0603]
FB1  220R  [FB_0603]
L1  3u3  [IND_0603]
R15  100K  [RES_0603]
R16  200K  [RES_0603]
R17  10R  [RES_0402]
R18  10R  [RES_0402]
R19  10R  [RES_0402]
R20  10R  [RES_0402]
R21  10R  [RES_0402]
R22  10R  [RES_0402]
R23  10K  [RES_0402]
R24  10K  [RES_0603]
R25  10K  [RES_0603]
R26  0R  [RES_0402]
R27  12K  [RES_0603]
R28  2K  [RES_0603]
U2  USB 3.1 TO RGMII  [LAN7801-I/9JX]  (value not drawn)
X2  25MHz  [XTAL_3225]

### Ports
CIRCUIT_NRST (bidir, see PHY SFC[2C], STM32 MCU[7A]), DP_GTX_CLK (bidir, see PHY SFC[3B]), DP_TX_CTRL (bidir, see PHY SFC[3B]), DP_TX_D0 (bidir, see PHY SFC[3B]), DP_TX_D1 (bidir, see PHY SFC[3B]), DP_TX_D2 (bidir, see PHY SFC[3B]), DP_TX_D3 (bidir, see PHY SFC[3B]), INT_N_LAN7801 (bidir, see STM32 MCU[4C]), LAN_RX_CLK (bidir, see PHY SFC[2B]), LAN_RX_CTL (bidir, see PHY SFC[2C]), LAN_RX_D1 (bidir, see PHY SFC[2C]), LAN_RX_D2 (bidir, see PHY SFC[2C]), LAN_RX_D3 (bidir, see PHY SFC[2C]), PHY_RST (bidir, see PHY SFC[3C]), RTL_RXD_D0 (bidir, see PHY SFC[2B]), USB2P0_N (bidir, see USB RGMII CONN[6B]), USB2P0_P (bidir, see USB RGMII CONN[6B]), USB3RX_N (bidir, see USB RGMII CONN[2B]), USB3RX_P (bidir, see USB RGMII CONN[2B]), USB3TX_N (bidir, see USB RGMII CONN[2B]), USB3TX_P (bidir, see USB RGMII CONN[2B])

### Nets
+3V3: C14.2 C17.2 C18.2 C22.2 C23.2 C24.2 C26.2 C27.2 C28.2 C29.2 C30.2 C31.2 C32.2 R23.2 R25.2 U2.3(VDDVARIO) U2.7(VDDVARIO) U2.11(VDDVARIO) U2.18(VDDVARIO) U2.21(VDD_SW_IN) U2.27(VDDVARIO) U2.48(VDDVARIO) U2.50(VDD33A) U2.51(VDDVARIO) U2.64(VDD33_REG_IN)
+VDD12: C25.2 FB1.1 L1.2 U2.22(VDD12_SW_FB)
+VDD12LAN: C15.2 C16.2 C19.2 C20.2 C21.2 FB1.2 U2.28(VDD12CORE) U2.37(VDD12A) U2.42(VDD12A) U2.54(VDD12CORE) U2.62(VDD12A)
GND: C14.1 C15.1 C16.1 C17.1 C18.1 C19.1 C20.1 C21.1 C22.1 C23.1 C24.1 C25.1 C26.1 C27.1 C28.1 C29.1 C30.1 C31.1 C32.1 C33.1 C34.1 C35.1 C36.1 C37.1 R16.1 R24.2 R27.1 R28.1 U2.EP X2.2 X2.4
VBUS: R15.2
CIRCUIT_NRST: U2.47(~{RESET_N}/PME_CLEAR) ; port CIRCUIT_NRST
DP_GTX_CLK: R21.1 ; port DP_GTX_CLK
DP_TX_CTRL: R22.1 ; port DP_TX_CTRL
DP_TX_D0: R20.1 ; port DP_TX_D0
DP_TX_D1: R19.1 ; port DP_TX_D1
DP_TX_D2: R18.1 ; port DP_TX_D2
DP_TX_D3: R17.1 ; port DP_TX_D3
DUPLEX: R25.1 U2.33(DUPLEX)
INT_N_LAN7801: R23.1 U2.31(~{PHY_INT_N}) ; port INT_N_LAN7801
LAN7801_XI: R26.2 U2.52(XI)
LAN7801_XO: C35.2 U2.53(XO) X2.3
LAN_GTX_CLK: R21.2 U2.10(TXC)
LAN_RX_CLK: U2.12(RXC) ; port LAN_RX_CLK
LAN_RX_CTL: U2.13(RX_CTL) ; port LAN_RX_CTL
LAN_RX_D0: U2.14(RXD0) ; port RTL_RXD_D0
LAN_RX_D1: U2.15(RXD1) ; port LAN_RX_D1
LAN_RX_D2: U2.16(RXD2) ; port LAN_RX_D2
LAN_RX_D3: U2.17(RXD3) ; port LAN_RX_D3
LAN_TX_CTRL: R22.2 U2.9(TX_CTL)
LAN_TX_D0: R20.2 U2.8(TXD0)
LAN_TX_D1: R19.2 U2.6(TXD1)
LAN_TX_D2: R18.2 U2.5(TXD2)
LAN_TX_D3: R17.2 U2.4(TXD3)
PHY_RST: U2.32(~{PHY_RESET_N}) ; port PHY_RST
REF_FILT: C37.2 U2.2(REF_FILT)
REF_REXT: R28.2 U2.1(REF_REXT)
REG OUT: C33.2 U2.63(VDD25_REG_OUT)
SW OUT: L1.1 U2.20(VDD12_SW_OUT)
TEST: R24.1 U2.46(TEST)
USB2P0_N: U2.39(USB2_DM) ; port USB2P0_N
USB2P0_P: U2.38(USB2_DP) ; port USB2P0_P
USB3RX_N: U2.40(USB3_TXDP) ; port USB3RX_N
USB3RX_P: U2.41(USB3_TXDM) ; port USB3RX_P
USB3TX_N: U2.43(USB3_RXDP) ; port USB3TX_N
USB3TX_P: U2.44(USB3_RXDM) ; port USB3TX_P
USBRBIAS: R27.2 U2.49(USBRBIAS)
VBUS_DET: C34.2 R15.1 R16.2 U2.29(VBUS_DET)
NetC36_2: C36.2 R26.1 X2.1

Not connected (* = marked no-connect by the designer): U2 19(CLK125)* 23(EECS/GPIO0)* 24(EEDI/GPIO1)* 25(EEDO/GPIO2)* 26(EECLK/GPIO3)* 30(~{SUSPEND_N})* 35(GPIO4)* 36(PME_MODE/GPIO5)* 45(~{PME_N}/GPIO6)* 55(MDIO)* 56(MDC)* 57(TDI/GPIO7)* 58(TCK/GPIO8)* 59(TMS/GPIO9)* 60(TDO/GPIO10)* 61(REFCLK_25/GPIO11)*

### Layout directives
differential pair; differential pair class DIFF_USB_90Ω; rule Matched Net Lengths [Delay Tolerance = 5ps]: USB3RX_N, USB3RX_P, USB3TX_N, USB3TX_P
net class GRMII_TX_R; rule Matched Net Lengths [Delay Tolerance = 20ps]: LAN_GTX_CLK, LAN_TX_CTRL, LAN_TX_D0, LAN_TX_D1, LAN_TX_D2, LAN_TX_D3
net class GRMII_TX; rule Matched Net Lengths [Delay Tolerance = 20ps]: DP_GTX_CLK, DP_TX_CTRL, DP_TX_D0, DP_TX_D1, DP_TX_D2, DP_TX_D3
net class GRMII_RX; rule Matched Net Lengths [Delay Tolerance = 20ps]: LAN_RX_CLK, LAN_RX_CTL, LAN_RX_D0, LAN_RX_D1, LAN_RX_D2, LAN_RX_D3
differential pair; differential pair class DIFF_USB_90Ω; rule Matched Net Lengths [Delay Tolerance = 100ps]: USB2P0_N, USB2P0_P

### Notes on the sheet
- Place Resistor Close to Chip
- (in symbol LAN7801-I/9JX) LAN7801; RGMII TO USB3.1
- (in symbol Title) TITLE; DATE; REVISION; DRAWN BY; PAGE; OF

### Library data of the parts
C14 C33 C37 = CAP_0603: [C15849]; Manufacturer: *; Manufacturer Part Number: *; Distributor Link: *; LCSC: *; Rating: *; Dielectric: *
C15 C16 C18-C24 C26-C32 = CAP_0603: [C14663]; Manufacturer: *; Manufacturer Part Number: *; Distributor Link: *; LCSC: *; Rating: *; Dielectric: *
C17 = CAP_0603: [C19666]; Manufacturer: *; Manufacturer Part Number: *; Distributor Link: *; LCSC: *; Rating: *; Dielectric: *
C25 = CAP_0603: [C59461]; Manufacturer: *; Manufacturer Part Number: *; Distributor Link: *; LCSC: *; Rating: *; Dielectric: *
C34 = CAP_0603: [C23630]; Manufacturer: *; Manufacturer Part Number: *; Distributor Link: *; LCSC: *; Rating: *; Dielectric: *
C35 C36 = CAP_0402: Capacitor SMD 0402 [C1549]; Manufacturer: *; Manufacturer Part Number: *; Distributor Link: *; LCSC: *; Rating: *; Dielectric: *
FB1 = FB_0603: [C88980]; Manufacturer: *; Manufacturer Part Number: *; Distributor Link: *; LCSC: *
L1 = IND_0603: [C281110]
R15 = RES_0603: [C25803]; Manufacturer: *; Manufacturer Part Number: *; Distributor Link: *; LCSC: *
R16 = RES_0603: [C25811]; Manufacturer: *; Manufacturer Part Number: *; Distributor Link: *; LCSC: *
R17-R22 = RES_0402: [C25077]; Manufacturer: *; Manufacturer Part Number: *; Distributor Link: *; LCSC: *
R23 = RES_0402: [C25744]; Manufacturer: *; Manufacturer Part Number: *; Distributor Link: *; LCSC: *
R24 R25 = RES_0603: [C25804]; Manufacturer: *; Manufacturer Part Number: *; Distributor Link: *; LCSC: *
R26 = RES_0402: Resistor SMD 0402 [C17168]; Manufacturer: *; Manufacturer Part Number: *; Distributor Link: *; LCSC: *
R27 = RES_0603: [C22790]; Manufacturer: *; Manufacturer Part Number: *; Distributor Link: *; LCSC: *
R28 = RES_0603: [C22975]; Manufacturer: *; Manufacturer Part Number: *; Distributor Link: *; LCSC: *
U2 = LAN7801-I/9JX: [C633491]
X2 = TSX-3225_24.0000MF15X-AC: as X1 on sheet PHY SFC

## Sheet USB RGMII CONN.SchDoc: C-F-U-Bridge
size A3; ApprovedBy: Luca Schenetti; CheckedBy: Luca Schenetti; Author: Luca Schenetti; DrawnBy: Luca Schenetti; Revision: A; SheetNumber: 6; SheetTotal: 7
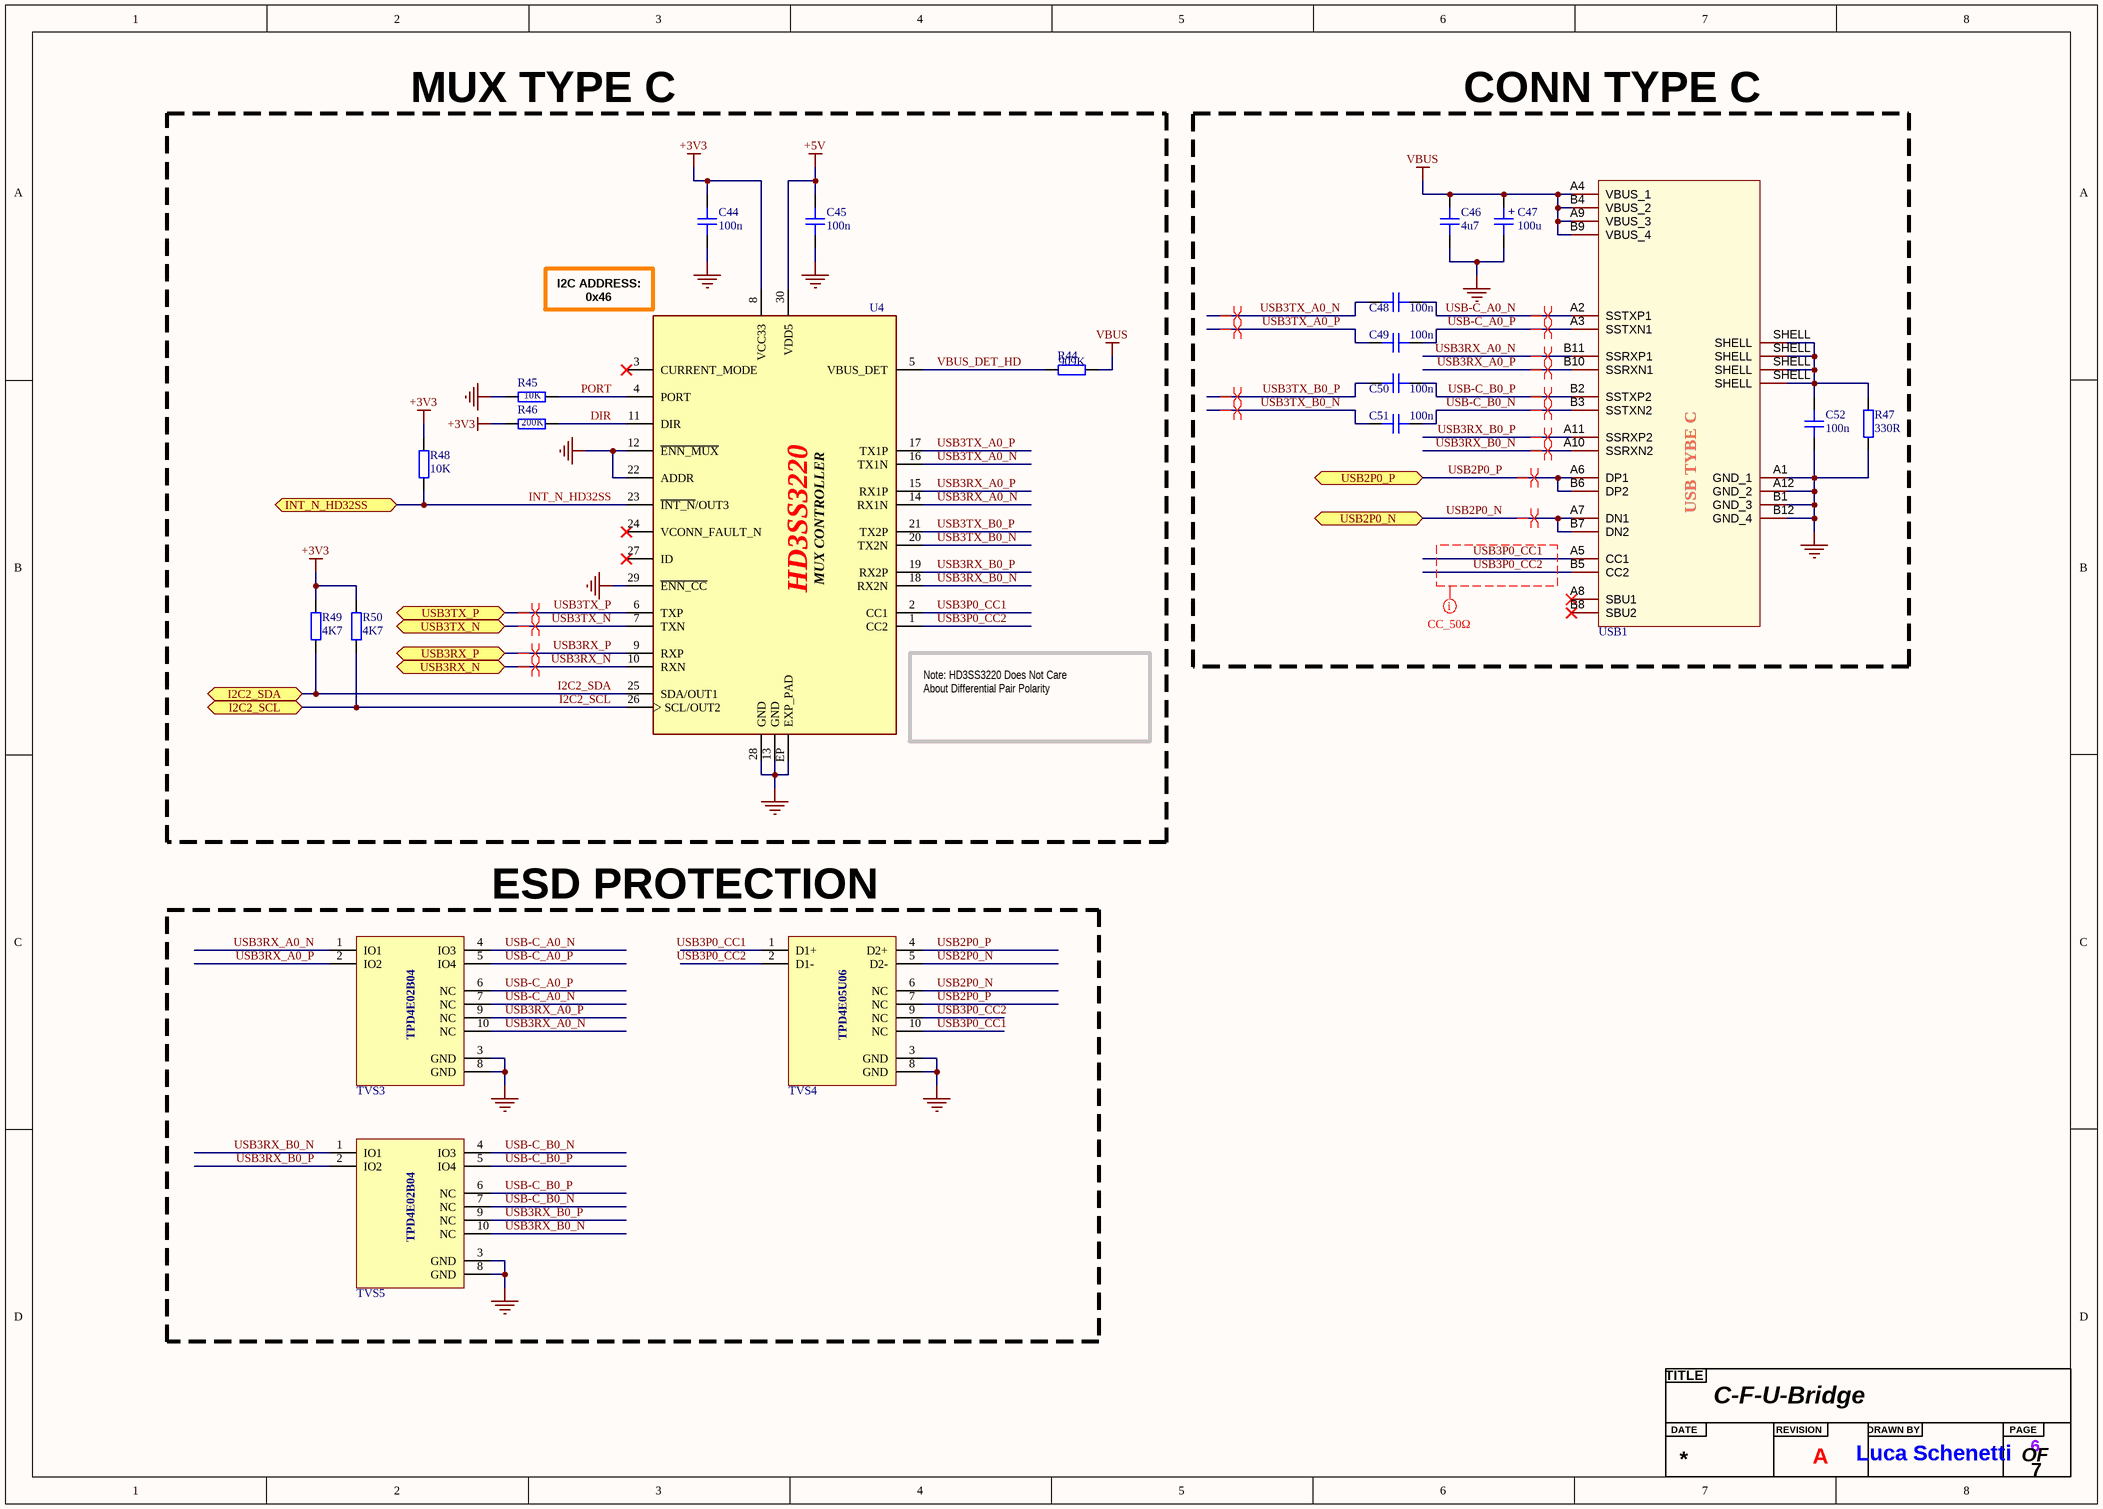
[diagram p5: USB RGMII CONN.SchDoc]

### Parts
(Parts that share a designator on the sheet are numbered #1, #2 ... from top to bottom, then left to right.)
?#6  Title  (value not drawn)  (graphical)
C44  100n  [CAP_0603]
C45  100n  [CAP_0603]
C46  4u7  [CAP_0805]
C47  100u  [CAP_AE_SMD_D6MM3_H5M55]
C48  100n  [CAP_0402]
C49  100n  [CAP_0402]
C50  100n  [CAP_0402]
C51  100n  [CAP_0402]
C52  100n  [CAP_0603]
R44  909K  [RES_0603]
R45  10K  [RES_0603]
R46  200K  [RES_0603]
R47  330R  [RES_0603]
R48  10K  [RES_0402]
R49  4K7  [RES_0402]
R50  4K7  [RES_0402]
TVS3  TVS DIODE USB 3  [TPD4E02B04DQAR]  (value not drawn)
TVS4  ESD and Surge Protection USB, HDMI & High Speed  [TPD4E05U06DQAR]  (value not drawn)
TVS5  TVS DIODE USB 3  [TPD4E02B04DQAR]  (value not drawn)
U4  USB Type-C MUX CONTROLLER  [HD3SS3220]  (value not drawn)
USB1  USB-C 24P SMD  [TYPE-C 24P QT 143]  (value not drawn)

### Blocks framed on the sheet
MUX TYPE C: C44 C45 R44-R46 R48-R50 U4
CONN TYPE C: C46-C52 R47 USB1
ESD PROTECTION: TVS3-TVS5

### Ports
I2C2_SCL (bidir, see STM32 MCU[4D]), I2C2_SDA (bidir, see STM32 MCU[4C]), INT_N_HD32SS (bidir, see STM32 MCU[2C]), USB2P0_N (bidir, see RGMII USB[6C]), USB2P0_P (bidir, see RGMII USB[6C]), USB3RX_N (bidir, see RGMII USB[6C]), USB3RX_P (bidir, see RGMII USB[6C]), USB3TX_N (bidir, see RGMII USB[6C]), USB3TX_P (bidir, see RGMII USB[6C])

### Nets
+3V3: C44.2 R46.1 R48.2 R49.2 R50.2 U4.8(VCC33)
+5V: C45.2 U4.30(VDD5)
GND: C44.1 C45.1 C46.1 C47.2 C52.1 R45.1 R47.1 TVS3.3(GND) TVS3.8(GND) TVS4.3(GND) TVS4.8(GND) TVS5.3(GND) TVS5.8(GND) U4.12(~{ENN_MUX}) U4.13(GND) U4.22(ADDR) U4.28(GND) U4.29(~{ENN_CC}) U4.EP(EXP_PAD) USB1.A1(GND_1) USB1.A12(GND_2) USB1.B1(GND_3) USB1.B12(GND_4)
VBUS: C46.2 C47.1 R44.2 USB1.A4(VBUS_1) USB1.A9(VBUS_3) USB1.B4(VBUS_2) USB1.B9(VBUS_4)
DIR: R46.2 U4.11(DIR)
I2C2_SCL: R50.1 U4.26(SCL/OUT2) ; port I2C2_SCL
I2C2_SDA: R49.1 U4.25(SDA/OUT1) ; port I2C2_SDA
INT_N_HD32SS: R48.1 U4.23(~{INT_N}/OUT3) ; port INT_N_HD32SS
PORT: R45.2 U4.4(PORT)
USB2P0_N: TVS4.5(D2-) TVS4.6(NC) USB1.A7(DN1) USB1.B7(DN2) ; port USB2P0_N
USB2P0_P: TVS4.4(D2+) TVS4.7(NC) USB1.A6(DP1) USB1.B6(DP2) ; port USB2P0_P
USB3P0_CC1: TVS4.1(D1+) TVS4.10(NC) U4.2(CC1) USB1.A5(CC1)
USB3P0_CC2: TVS4.2(D1-) TVS4.9(NC) U4.1(CC2) USB1.B5(CC2)
USB3RX_A0_N: TVS3.1(IO1) TVS3.10(NC) U4.14(RX1N) USB1.B11(SSRXP1)
USB3RX_A0_P: TVS3.2(IO2) TVS3.9(NC) U4.15(RX1P) USB1.B10(SSRXN1)
USB3RX_B0_N: TVS5.1(IO1) TVS5.10(NC) U4.18(RX2N) USB1.A10(SSRXN2)
USB3RX_B0_P: TVS5.2(IO2) TVS5.9(NC) U4.19(RX2P) USB1.A11(SSRXP2)
USB3RX_N: U4.10(RXN) ; port USB3RX_N
USB3RX_P: U4.9(RXP) ; port USB3RX_P
USB3TX_A0_N: C48.1 U4.16(TX1N)
USB3TX_A0_P: C49.1 U4.17(TX1P)
USB3TX_B0_N: C51.1 U4.20(TX2N)
USB3TX_B0_P: C50.1 U4.21(TX2P)
USB3TX_N: U4.7(TXN) ; port USB3TX_N
USB3TX_P: U4.6(TXP) ; port USB3TX_P
USB-C_A0_N: C48.2 TVS3.4(IO3) TVS3.7(NC) USB1.A2(SSTXP1)
USB-C_A0_P: C49.2 TVS3.5(IO4) TVS3.6(NC) USB1.A3(SSTXN1)
USB-C_B0_N: C51.2 TVS5.4(IO3) TVS5.7(NC) USB1.B3(SSTXN2)
USB-C_B0_P: C50.2 TVS5.5(IO4) TVS5.6(NC) USB1.B2(SSTXP2)
VBUS_DET_HD: R44.1 U4.5(VBUS_DET)
NetC52_2: C52.2 R47.2 USB1.SHELL

Not connected (* = marked no-connect by the designer): U4 3(CURRENT_MODE)* 24(VCONN_FAULT_N)* 27(ID)*; USB1 A8(SBU1)* B8(SBU2)*

### Layout directives
net class CC_50Ω: USB3P0_CC1, USB3P0_CC2
differential pair; differential pair class DIFF_USB_90Ω; rule Matched Net Lengths [Delay Tolerance = 5ps]: USB3RX_A0_N, USB3RX_A0_P, USB3RX_B0_N, USB3RX_B0_P, USB3RX_N, USB3RX_P, USB3TX_A0_N, USB3TX_A0_P, USB3TX_B0_N, USB3TX_B0_P, USB3TX_N, USB3TX_P, USB-C_A0_N, USB-C_A0_P, USB-C_B0_N, USB-C_B0_P
differential pair; differential pair class DIFF_USB_90Ω; rule Matched Net Lengths [Delay Tolerance = 100ps]: USB2P0_N, USB2P0_P

### Notes on the sheet
- (near U4) I2C ADDRESS:
  0x46
- (near U4) Note: HD3SS3220 Does Not Care
  About Differential Pair Polarity
- (in symbol CAP_ALEL_6.3x5.5) +
- (in symbol HD3SS3220RNHR) HD3SS3220; MUX CONTROLLER
- (in symbol Title) TITLE; DATE; REVISION; DRAWN BY; PAGE; OF
- (in symbol TPD4E02B04DQAR) TPD4E02B04
- (in symbol TPD4E05U06DQAR) TPD4E05U06
- (in symbol USB-C 24P) USB TYBE C

### Library data of the parts
C44 C45 = CAP_0603: [C14663]; Manufacturer: *; Manufacturer Part Number: *; Distributor Link: *; LCSC: *; Rating: *; Dielectric: *
C46 = CAP_0805: [C1779]; Manufacturer: *; Manufacturer Part Number: *; Distributor Link: *; LCSC: *; Rating: *; Dielectric: *
C47 = CAP_ALEL_6.3x5.5: [C59936]; Manufacturer: *; Manufacturer Part Number: *; Distributor Link: *; LCSC: *
C48-C51 = CAP_0402: Capacitor SMD 0402[C1525]; Manufacturer: *; Manufacturer Part Number: *; Distributor Link: *; LCSC: *; Rating: *; Dielectric: *
C52 = CAP_0603: Capacitor SMD 0603 [C14663]; Manufacturer: *; Manufacturer Part Number: *; Distributor Link: *; LCSC: *; Rating: *; Dielectric: *
R44 = RES_0603: [C403391]; Manufacturer: *; Manufacturer Part Number: *; Distributor Link: *; LCSC: *
R45 = RES_0603: [C25804]; Manufacturer: *; Manufacturer Part Number: *; Distributor Link: *; LCSC: *
R46 = RES_0603: [C25811]; Manufacturer: *; Manufacturer Part Number: *; Distributor Link: *; LCSC: *
R47 = RES_0603: [C23138]; Manufacturer: *; Manufacturer Part Number: *; Distributor Link: *; LCSC: *
R48 = RES_0402: [C25744]; Manufacturer: *; Manufacturer Part Number: *; Distributor Link: *; LCSC: *
R49 R50 = RES_0402: [C23162]; Manufacturer: *; Manufacturer Part Number: *; Distributor Link: *; LCSC: *
TVS3 TVS5 = TPD4E02B04DQAR: [C106794]
TVS4 = TPD4E05U06DQAR: [C138714]
U4 = HD3SS3220RNHR: [C165155]
USB1 = USB-C 24P: [C5156605]

## Sheet STM32 MCU.SchDoc: C-F-U-Bridge
size A3; ApprovedBy: Luca Schenetti; CheckedBy: Luca Schenetti; Author: Luca Schenetti; DrawnBy: Luca Schenetti; Engineer: Luca Schenetti; Revision: A; SheetNumber: 7; SheetTotal: 7
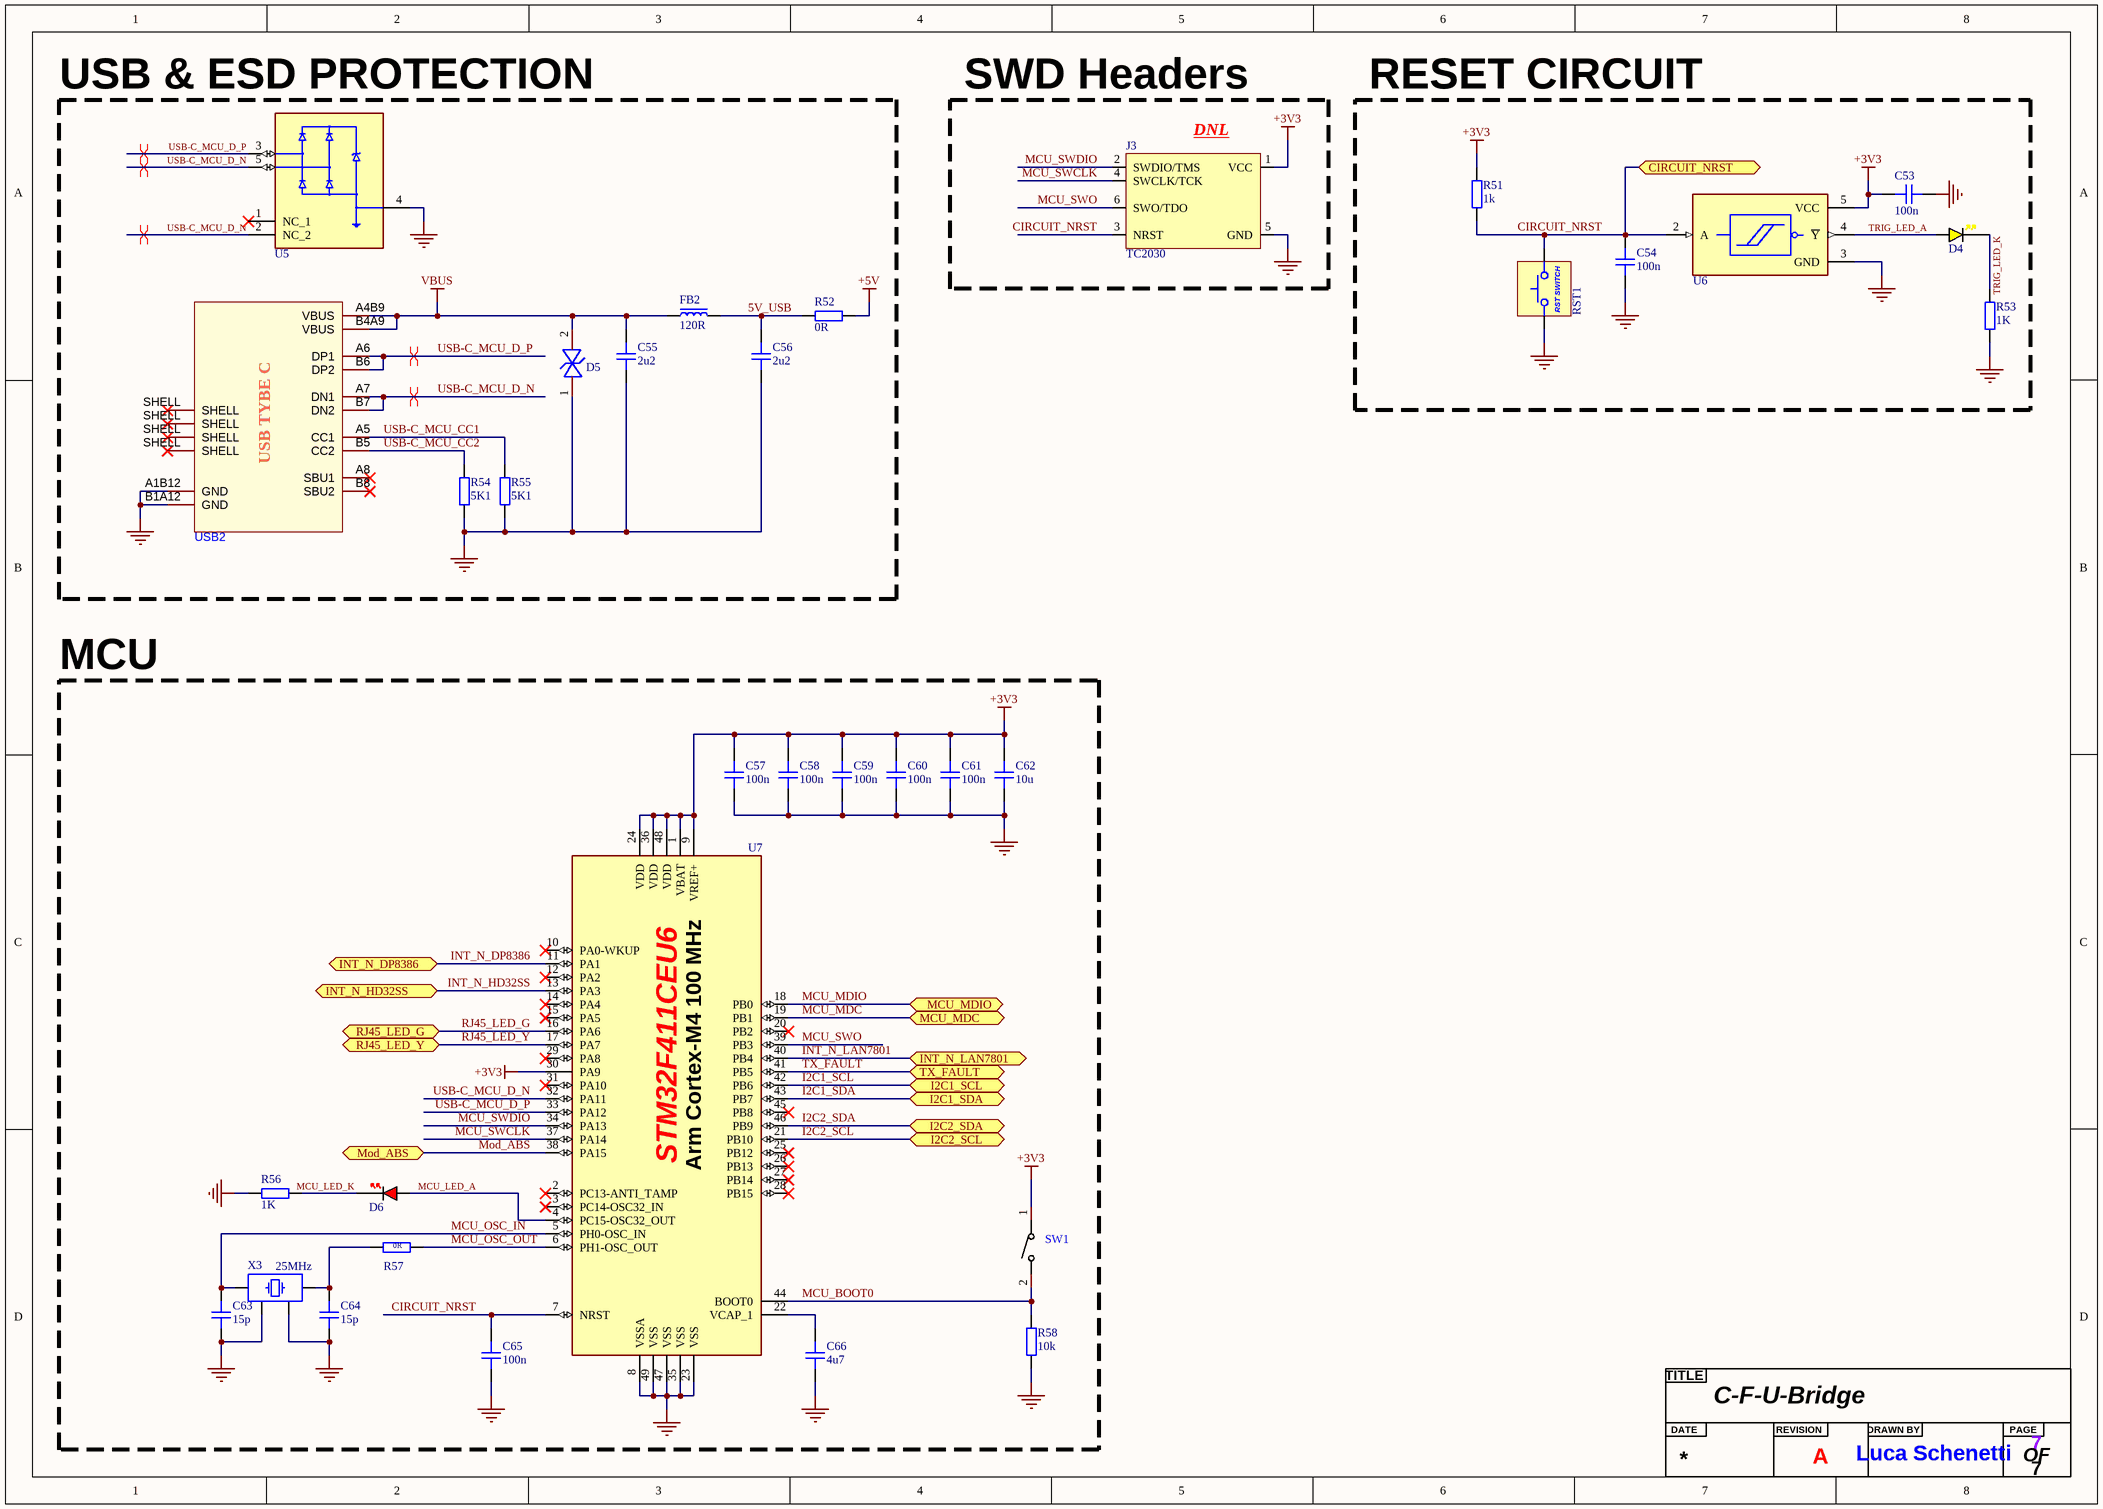
[diagram p6: STM32 MCU.SchDoc]

### Parts
(Parts that share a designator on the sheet are numbered #1, #2 ... from top to bottom, then left to right.)
?#7  Title  (value not drawn)  (graphical)
C53  100n  [CAP_0402]
C54  100n  [CAP_0402]
C55  2u2  [CAP_0603]
C56  2u2  [CAP_0603]
C57  100n  [CAP_0603]
C58  100n  [CAP_0603]
C59  100n  [CAP_0603]
C60  100n  [CAP_0603]
C61  100n  [CAP_0603]
C62  10u  [CAP_0603]
C63  15p  [CAP_0402]
C64  15p  [CAP_0402]
C65  100n  [CAP_0603]
C66  4u7  [CAP_0603]
D4  YELLOW  [LED_0603_YELLOW]  (value not drawn)
D5  ESD Protection TVS 6.0V  [SMF6.0CA]  (value not drawn)
D6  RED  [LED_0603_RED]  (value not drawn)
FB2  120R  [FB_0603]
J3  TC2030  [TC2030-FP]  (no BOM)
R51  1k  [RES_0402]
R52  0R  [RES_0603]
R53  1K  [RES_0402]
R54  5K1  [RES_0603]
R55  5K1  [RES_0603]
R56  1K  [RES_0402]
R57  0R  [RES_0402]
R58  10k  [RES_0603]
RST1  RST_SWITCH_STM32  [RST_SWITCH]  (value not drawn)
SW1  TS-1088-AR02016  [TS-1088-AR02016]  (value not drawn)
U5  TVS USB 2.0 ±25-kV  [TPD2E2U06DRLR]  (value not drawn)
U6  Schmitt Trigger 1.65V~5.5V  [74LVC1G14GW,125]  (value not drawn)
U7  ARM® Cortex®-M4 STM32F4  [STM32F411CEU6]  (value not drawn)
USB2  USB-C CONNECTOR  [USB-3.1-SMD_U262-161N-4BVC11]  (value not drawn)
X3  25MHz  [XTAL_3225]

### Blocks framed on the sheet
USB & ESD PROTECTION: C55 C56 D5 FB2 R52 R54 R55 U5 USB2
SWD Headers: J3
RESET CIRCUIT: C53 C54 D4 R51 R53 RST1 U6
MCU: C57-C66 D6 R56-R58 SW1 U7 X3

### Ports
CIRCUIT_NRST (bidir, see PHY SFC[2C], RGMII USB[3D]), I2C1_SCL (bidir, see PHY SFC CONN[4B]), I2C1_SDA (bidir, see PHY SFC CONN[4B]), I2C2_SCL (bidir, see USB RGMII CONN[1B]), I2C2_SDA (bidir, see USB RGMII CONN[1B]), INT_N_DP8386 (bidir, see PHY SFC[2B]), INT_N_HD32SS (bidir, see USB RGMII CONN[2B]), INT_N_LAN7801 (bidir, see RGMII USB[6C]), MCU_MDC (bidir, see PHY SFC[2B]), MCU_MDIO (bidir, see PHY SFC[2B]), Mod_ABS (bidir, see PHY SFC CONN[4B]), RJ45_LED_G (bidir, see PHY SFC CONN[4C]), RJ45_LED_Y (bidir, see PHY SFC CONN[4C]), TX_FAULT (bidir, see PHY SFC CONN[4A])

### Nets
+3V3: C53.2 C57.2 C58.2 C59.2 C60.2 C61.2 C62.2 J3.1(VCC) R51.2 SW1.1 U6.5(VCC) U7.1(VBAT) U7.9(VREF+) U7.24(VDD) U7.30(PA9) U7.36(VDD) U7.48(VDD)
+5V: R52.2
GND: C53.1 C54.1 C55.1 C56.1 C57.1 C58.1 C59.1 C60.1 C61.1 C62.1 C63.1 C64.1 C65.1 C66.1 D5.1(C) J3.5(GND) R53.1 R54.1 R55.1 R56.1 R58.1 RST1.1 U5.4(GND) U6.3(GND) U7.8(VSSA) U7.23(VSS) U7.35(VSS) U7.47(VSS) U7.49(VSS) USB2.A1B12(GND) USB2.B1A12(GND) X3.2 X3.4
VBUS: C55.2 D5.2(A) FB2.1 USB2.A4B9(VBUS) USB2.B4A9(VBUS)
5V_USB: C56.2 FB2.2 R52.1
CIRCUIT_NRST: C54.2 C65.2 J3.3(NRST) R51.1 RST1.2 U6.2(A) U7.7(NRST) ; port CIRCUIT_NRST
I2C1_SCL: U7.42(PB6) ; port I2C1_SCL
I2C1_SDA: U7.43(PB7) ; port I2C1_SDA
I2C2_SCL: U7.21(PB10) ; port I2C2_SCL
I2C2_SDA: U7.46(PB9) ; port I2C2_SDA
INT_N_DP8386: U7.11(PA1) ; port INT_N_DP8386
INT_N_HD32SS: U7.13(PA3) ; port INT_N_HD32SS
INT_N_LAN7801: U7.40(PB4) ; port INT_N_LAN7801
MCU_BOOT0: R58.2 SW1.2 U7.44(BOOT0)
MCU_LED_A: D6.A U7.4(PC15-OSC32_OUT)
MCU_LED_K: D6.K R56.2
MCU_MDC: U7.19(PB1) ; port MCU_MDC
MCU_MDIO: U7.18(PB0) ; port MCU_MDIO
MCU_OSC_IN: C63.2 U7.5(PH0-OSC_IN) X3.3
MCU_OSC_OUT: R57.2 U7.6(PH1-OSC_OUT)
MCU_SWCLK: J3.4(SWCLK/TCK) U7.37(PA14)
MCU_SWDIO: J3.2(SWDIO/TMS) U7.34(PA13)
MCU_SWO: J3.6(SWO/TDO) U7.39(PB3)
Mod_ABS: U7.38(PA15) ; port Mod_ABS
RJ45_LED_G: U7.16(PA6) ; port RJ45_LED_G
RJ45_LED_Y: U7.17(PA7) ; port RJ45_LED_Y
TRIG_LED_A: D4.A U6.4(~{Y})
TRIG_LED_K: D4.K R53.2
TX_FAULT: U7.41(PB5) ; port TX_FAULT
USB-C_MCU_CC1: R55.2 USB2.A5(CC1)
USB-C_MCU_CC2: R54.2 USB2.B5(CC2)
USB-C_MCU_D_N: U5.2(NC_2) U5.5(IO2) U7.32(PA11) USB2.A7(DN1) USB2.B7(DN2)
USB-C_MCU_D_P: U5.3(IO1) U7.33(PA12) USB2.A6(DP1) USB2.B6(DP2)
NetC64_2: C64.2 R57.1 X3.1
NetC66_2: C66.2 U7.22(VCAP_1)

Not connected (* = marked no-connect by the designer): U5 1(NC_1)*; U7 2(PC13-ANTI_TAMP)* 3(PC14-OSC32_IN)* 10(PA0-WKUP)* 12(PA2)* 14(PA4)* 15(PA5)* 20(PB2)* 25(PB12)* 26(PB13)* 27(PB14)* 28(PB15)* 29(PA8)* 31(PA10)* 45(PB8)*; USB2 A8(SBU1)* B8(SBU2)* SHELL*

### Layout directives
differential pair; differential pair class DIFF_USB_90Ω: USB-C_MCU_D_N, USB-C_MCU_D_P

### Notes on the sheet
- (near J3) DNL
- (in symbol RST_SWITCH) RST SWITCH
- (in symbol STM32F411CEU6) Arm Cortex-M4 100 MHz
- (in symbol Title) TITLE; DATE; REVISION; DRAWN BY; PAGE; OF
- (in symbol U262-161N-4BVC11) USB TYBE C

### Library data of the parts
C53 C54 = CAP_0402: Capacitor SMD 0402 [C1525]; Manufacturer: *; Manufacturer Part Number: *; Distributor Link: *; LCSC: *; Rating: *; Dielectric: *
C55 C56 = CAP_0603: Capacitor SMD 0603 [C23630]; Manufacturer: *; Manufacturer Part Number: *; Distributor Link: *; LCSC: *; Rating: *; Dielectric: *
C57-C61 C65 = CAP_0603: Capacitor SMD 0603 [C14663]; Manufacturer: *; Manufacturer Part Number: *; Distributor Link: *; LCSC: *; Rating: *; Dielectric: *
C62 = CAP_0603: Capacitor SMD 0603 [C96446]; Manufacturer: *; Manufacturer Part Number: *; Distributor Link: *; LCSC: *; Rating: *; Dielectric: *
C63 C64 = CAP_0402: Capacitor SMD 0402 [C1548]; Manufacturer: *; Manufacturer Part Number: *; Distributor Link: *; LCSC: *; Rating: *; Dielectric: *
C66 = CAP_0603: Capacitor SMD 0603 [C19666]; Manufacturer: *; Manufacturer Part Number: *; Distributor Link: *; LCSC: *; Rating: *; Dielectric: *
D4 = LED_0603_YELLOW: LED 0603 YELLOW SMD[C72038]
D5 = SMF6.0CA: [C2990473]
D6 = LED_0603_RED: LED 0603 RED SMD[C2926776]
FB2 = FB_0603: Ferrite Bead SMD 0603[C76892]; Manufacturer: *; Manufacturer Part Number: *; Distributor Link: *; LCSC: *
J3 = TC2030: Tag-Connect No-Solder SWD Debug Connector DO NOT PLACE; Manufacturer: Tag-Connect; Manufacturer Part Number: TC2030
R51 R53 R56 = RES_0402: Resistor SMD 0402 [C11702]; Manufacturer: *; Manufacturer Part Number: *; Distributor Link: *; LCSC: *
R52 = RES_0603: [C21189]; Manufacturer: *; Manufacturer Part Number: *; Distributor Link: *; LCSC: *
R54 R55 = RES_0603: [C23186]; Manufacturer: *; Manufacturer Part Number: *; Distributor Link: *; LCSC: *
R57 = RES_0402: Resistor SMD 0402 [C17168]; Manufacturer: *; Manufacturer Part Number: *; Distributor Link: *; LCSC: *
R58 = RES_0603: Resistor SMD 0603[C25804]; Manufacturer: *; Manufacturer Part Number: *; Distributor Link: *; LCSC: *
RST1 = RST_SWITCH: [C720477]
SW1 = TS-1088-AR02016: [C720477]; Manufacturer: XUNPU(讯普); Add into BOM: yes; Circuit: SPST; Actuator Style: Round Button; Operating Force: 160gf; Switch Length: 4mm; Switch Width: 3mm; Switch Height: 2mm; Strike Gundam: 不带; Contact Current: 50mA; Voltage Rating (DC): 12V; Insulation Resistance: 100MΩ; Actuator/Cap Color: Black; Pin Style: SMDSplicing; Mechanical Life: 10万次; Symbol: TS-1088-AR02016; Device: TS-1088-AR02016; Supplier: LCSC; Supplier Part: C720477; Manufacturer Part: TS-1088-AR02016; JLCPCB Part Class: Extended Part; LCSC Part Name: 4*3*2mm 立贴 轻触开关; Supplier Footprint: SMD; Datasheet: https://atta.szlcsc.com/upload/public/pdf/source/20200810/C720475_60D09DD6C54279ADDB2DC25100F1CC11.pdf; Convert to PCB: yes; Mounting Style: Brick nogging; Operating Temperature: -30℃~+80℃
U5 = TPD2E2U06DRLR: [C1972959]
U6 = 74LVC1G14GW,125: [C265125]
U7 = STM32F411CEU6: [C60420]
USB2 = U262-161N-4BVC11: [C319148]; Manufacturer: XKB Connectivity(中国星坤); Symbol: U262-16XN-4BVC11; Add into BOM: yes; Connector Type: Type-C; Gender: Female; Number of Ports: 1; Number of Contacts: 16P; Current Rating - Power (Max): 3A; Soldering Temperature(Max): 260℃; Device: U262-161N-4BVC11; LCSC Part Name: Type-C 母 卧贴; Supplier Part: C319148; Manufacturer Part: U262-161N-4BVC11; Supplier Footprint: SMD; JLCPCB Part Class: Extended Part; Datasheet: https://atta.szlcsc.com/upload/public/pdf/source/20211015/B478CBA0F1623DA36A6CC6918C49C838.pdf; Supplier: LCSC; Convert to PCB: yes; Standard: USB 3.1; Mounting Style: 卧贴; Contact Material: Copper Alloy; Contact Plating: Gold; Operating Temperature Range: -40℃~+85℃
X3 = TSX-3225_24.0000MF15X-AC: as X1 on sheet PHY SFC

## Nets that join several sheets
+1V1: PWR RAIL (6 pins), PHY SFC (7 pins)
+2V5: PWR RAIL (6 pins), PHY SFC (5 pins)
+3V3: PWR RAIL (6 pins), PHY SFC (11 pins), PHY SFC CONN (12 pins), RGMII USB (25 pins), USB RGMII CONN (6 pins), STM32 MCU (17 pins)
+5V: PWR RAIL (13 pins), USB RGMII CONN (C45.2 U4.30), STM32 MCU (R52.2)
+VDD12: PWR RAIL (TP6.1), RGMII USB (C25.2 FB1.1 L1.2 U2.22)
GND: PWR RAIL (29 pins), PHY SFC (17 pins), PHY SFC CONN (25 pins), RGMII USB (31 pins), USB RGMII CONN (23 pins), STM32 MCU (33 pins)
VBUS: PWR RAIL (C87.2 R65.2 U11.5), RGMII USB (R15.2), USB RGMII CONN (7 pins), STM32 MCU (5 pins)
CIRCUIT_NRST: PHY SFC (R10.1), RGMII USB (U2.47), STM32 MCU (7 pins)
DP_GTX_CLK: PHY SFC (U1.29), RGMII USB (R21.1)
DP_TX_CTRL: PHY SFC (U1.37), RGMII USB (R22.1)
DP_TX_D0: PHY SFC (U1.28), RGMII USB (R20.1)
DP_TX_D1: PHY SFC (U1.27), RGMII USB (R19.1)
DP_TX_D2: PHY SFC (U1.26), RGMII USB (R18.1)
DP_TX_D3: PHY SFC (U1.25), RGMII USB (R17.1)
ETH_MDI0_N: PHY SFC (U1.2), PHY SFC CONN (J2.3 TVS1.2 TVS1.9)
ETH_MDI0_P: PHY SFC (U1.1 ), PHY SFC CONN (J2.2 TVS1.1 TVS1.10)
ETH_MDI1_N: PHY SFC (U1.5), PHY SFC CONN (J2.7 TVS1.5 TVS1.6)
ETH_MDI1_P: PHY SFC (U1.4), PHY SFC CONN (J2.4 TVS1.4 TVS1.7)
ETH_MDI2_N: PHY SFC (U1.8), PHY SFC CONN (J2.6 TVS2.2 TVS2.9)
ETH_MDI2_P: PHY SFC (U1.7), PHY SFC CONN (J2.5 TVS2.1 TVS2.10)
ETH_MDI3_N: PHY SFC (U1.11), PHY SFC CONN (J2.9 TVS2.5 TVS2.6)
ETH_MDI3_P: PHY SFC (U1.10), PHY SFC CONN (J2.8 TVS2.4 TVS2.7)
I2C1_SCL: PHY SFC CONN (J1.5 R34.1), STM32 MCU (U7.42)
I2C1_SDA: PHY SFC CONN (J1.4 R33.1), STM32 MCU (U7.43)
I2C2_SCL: USB RGMII CONN (R50.1 U4.26), STM32 MCU (U7.21)
I2C2_SDA: USB RGMII CONN (R49.1 U4.25), STM32 MCU (U7.46)
INT_N_DP8386: PHY SFC (R2.1 U1.44), STM32 MCU (U7.11)
INT_N_HD32SS: USB RGMII CONN (R48.1 U4.23), STM32 MCU (U7.13)
INT_N_LAN7801: RGMII USB (R23.1 U2.31), STM32 MCU (U7.40)
LAN_RX_CLK: PHY SFC (R3.1), RGMII USB (U2.12)
LAN_RX_CTL: PHY SFC (R8.1), RGMII USB (U2.13)
LAN_RX_D0: PHY SFC (R4.1), RGMII USB (U2.14)
LAN_RX_D1: PHY SFC (R5.1), RGMII USB (U2.15)
LAN_RX_D2: PHY SFC (R6.1), RGMII USB (U2.16)
LAN_RX_D3: PHY SFC (R7.1), RGMII USB (U2.17)
LED_0: PHY SFC (U1.47), PHY SFC CONN (D1.A)
LED_1: PHY SFC (U1.46), PHY SFC CONN (D3.K R30.1)
LED_2: PHY SFC (U1.45), PHY SFC CONN (D2.A)
MCU_MDC: PHY SFC (U1.42), STM32 MCU (U7.19)
MCU_MDIO: PHY SFC (R1.1 U1.41), STM32 MCU (U7.18)
Mod_ABS: PHY SFC CONN (J1.6 R35.1), STM32 MCU (U7.38)
PHY_RST: PHY SFC (R10.2 U1.43), RGMII USB (U2.32)
RJ45_LED_G: PHY SFC CONN (R41.1), STM32 MCU (U7.16)
RJ45_LED_Y: PHY SFC CONN (R42.1), STM32 MCU (U7.17)
SD: PHY SFC (U1.24), PHY SFC CONN (J1.8 R36.1)
SGMII_RD_N: PHY SFC (U1.17), PHY SFC CONN (J1.12)
SGMII_RD_P: PHY SFC (U1.16), PHY SFC CONN (J1.13)
SGMII_TD_N: PHY SFC (U1.14), PHY SFC CONN (J1.19)
SGMII_TD_P: PHY SFC (U1.15), PHY SFC CONN (J1.18)
TX_FAULT: PHY SFC CONN (J1.2 R31.1), STM32 MCU (U7.41)
USB2P0_N: RGMII USB (U2.39), USB RGMII CONN (TVS4.5 TVS4.6 USB1.A7 USB1.B7)
USB2P0_P: RGMII USB (U2.38), USB RGMII CONN (TVS4.4 TVS4.7 USB1.A6 USB1.B6)
USB3RX_N: RGMII USB (U2.40), USB RGMII CONN (U4.10)
USB3RX_P: RGMII USB (U2.41), USB RGMII CONN (U4.9)
USB3TX_N: RGMII USB (U2.43), USB RGMII CONN (U4.7)
USB3TX_P: RGMII USB (U2.44), USB RGMII CONN (U4.6)